# Altium schematic sheet Driver.SchDoc (part 1 of 2)
size 1600 x 1200 mm; SheetNumber: 1; SheetTotal: 1; SPICEModelCacheBTRAQOWF: <root> / <DocumentId>BTRAQOWF</DocumentId> / <CacheFrame Number="0"> / <Model Name="7850_74477530_1m" Kind="CKT"> / <Text>******* / .subckt 7850_74477530_1m 1 2 / Rp 1 2 187304.915771 / Cp 1 2 4.36976277949p / Rs 1 N3 3.3 / L1 N3 2 1000u / .ends 7850_74477530_1m</Text> / </Model> / </CacheFrame> / </root>
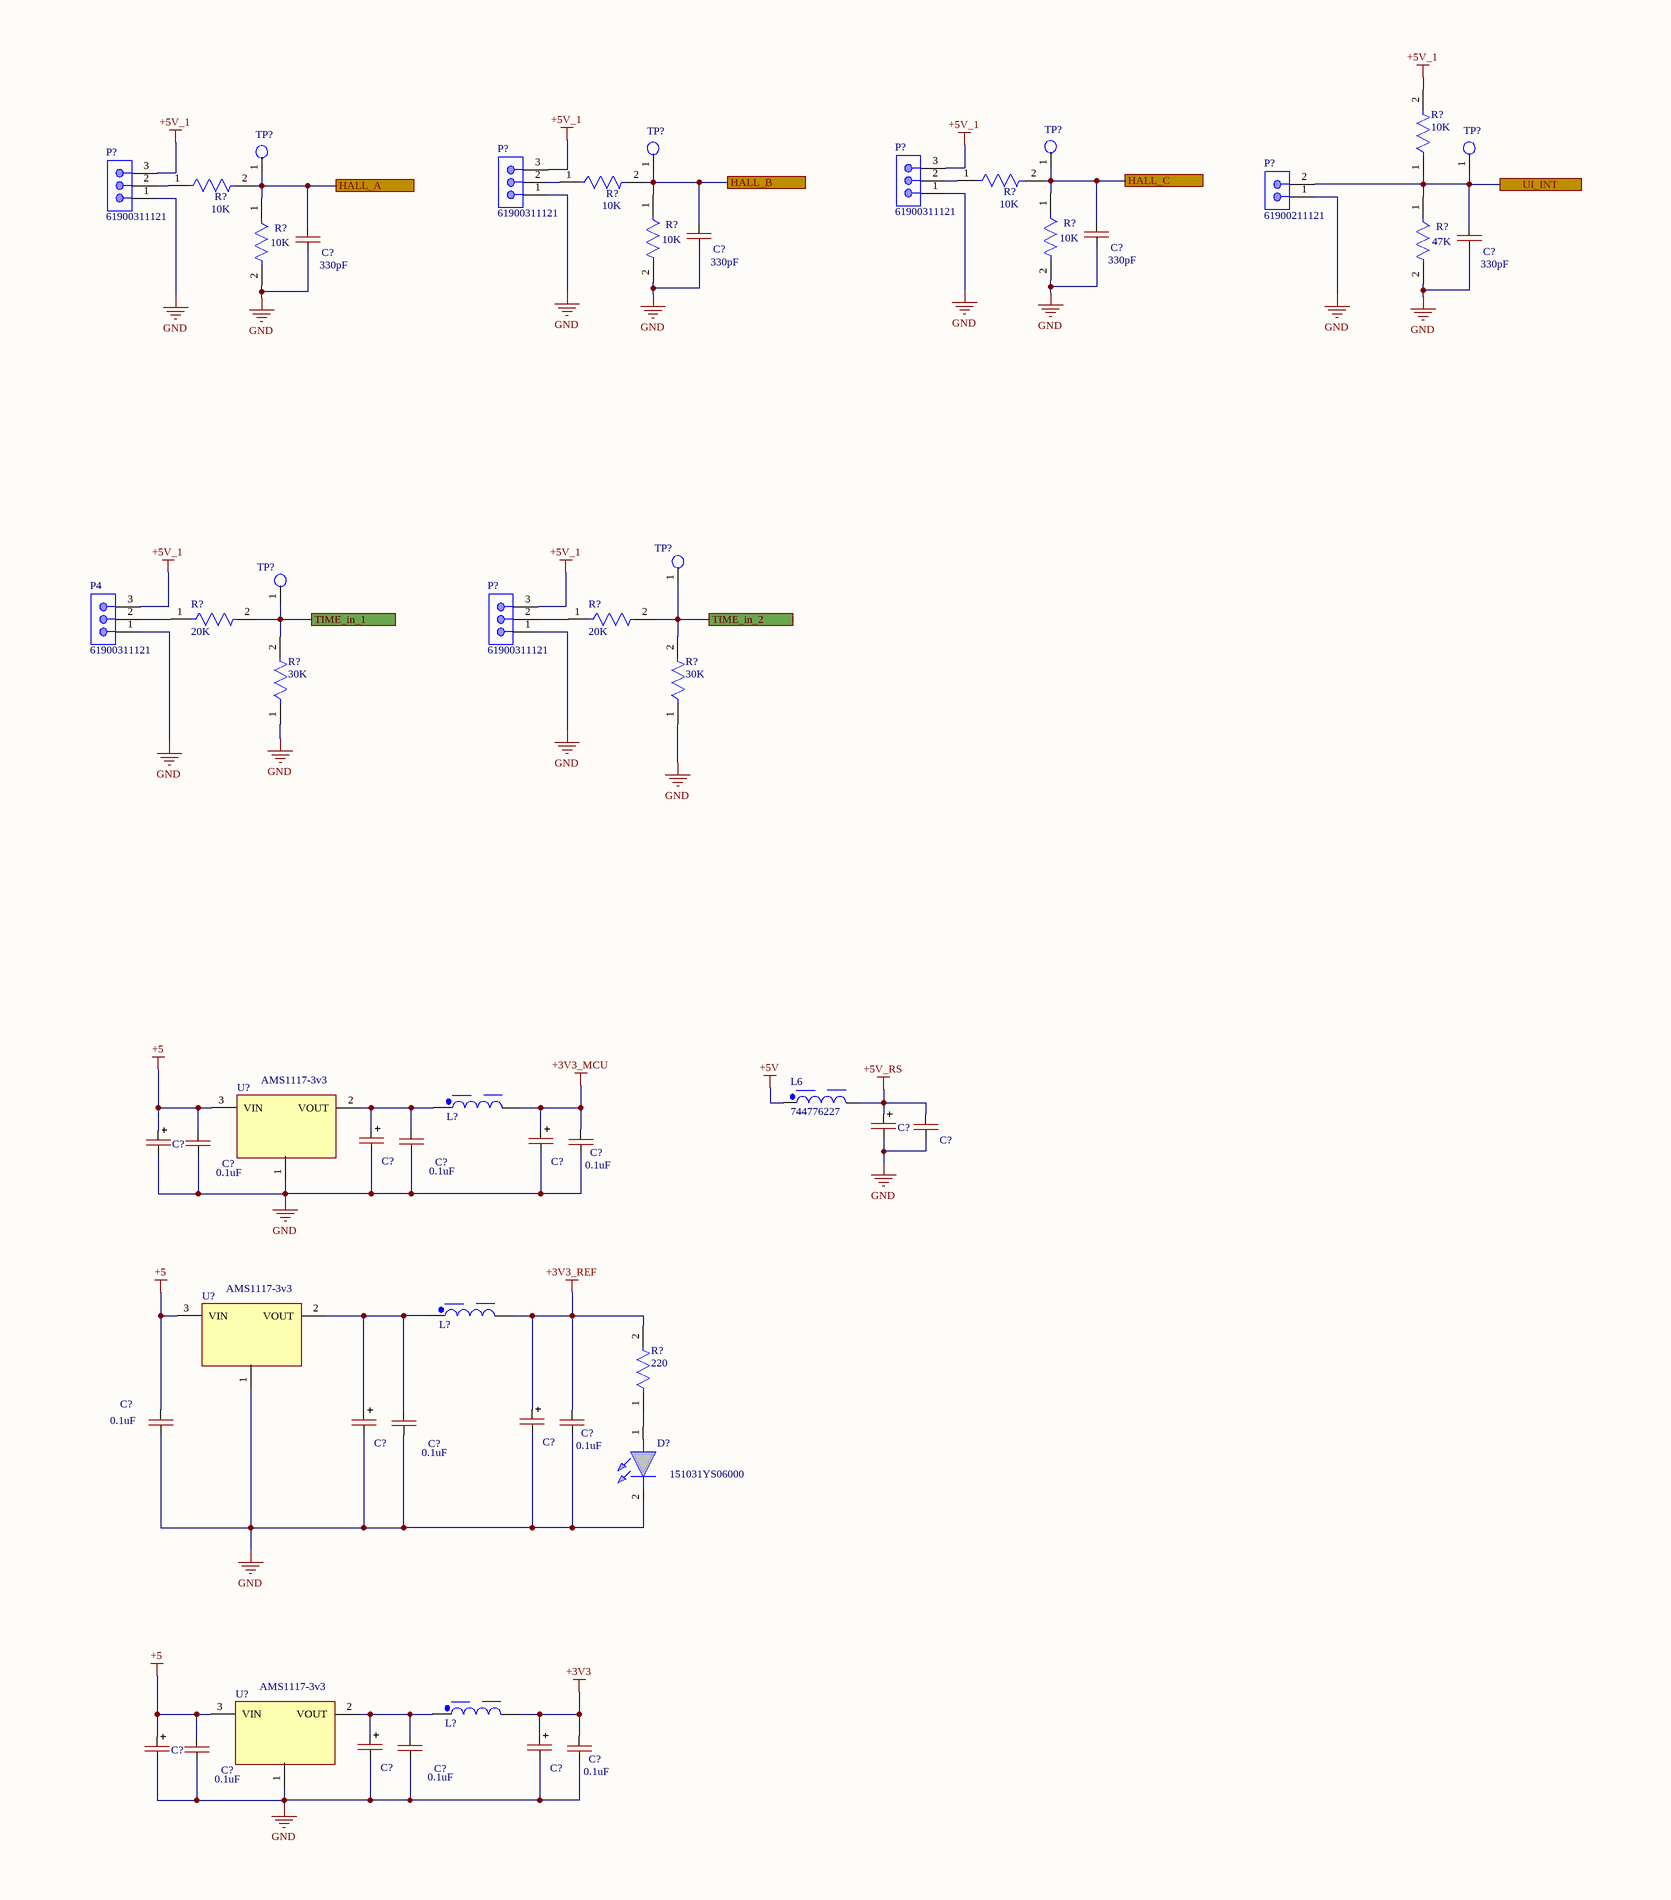
[diagram p0: Driver.SchDoc, top column 1 of 4]
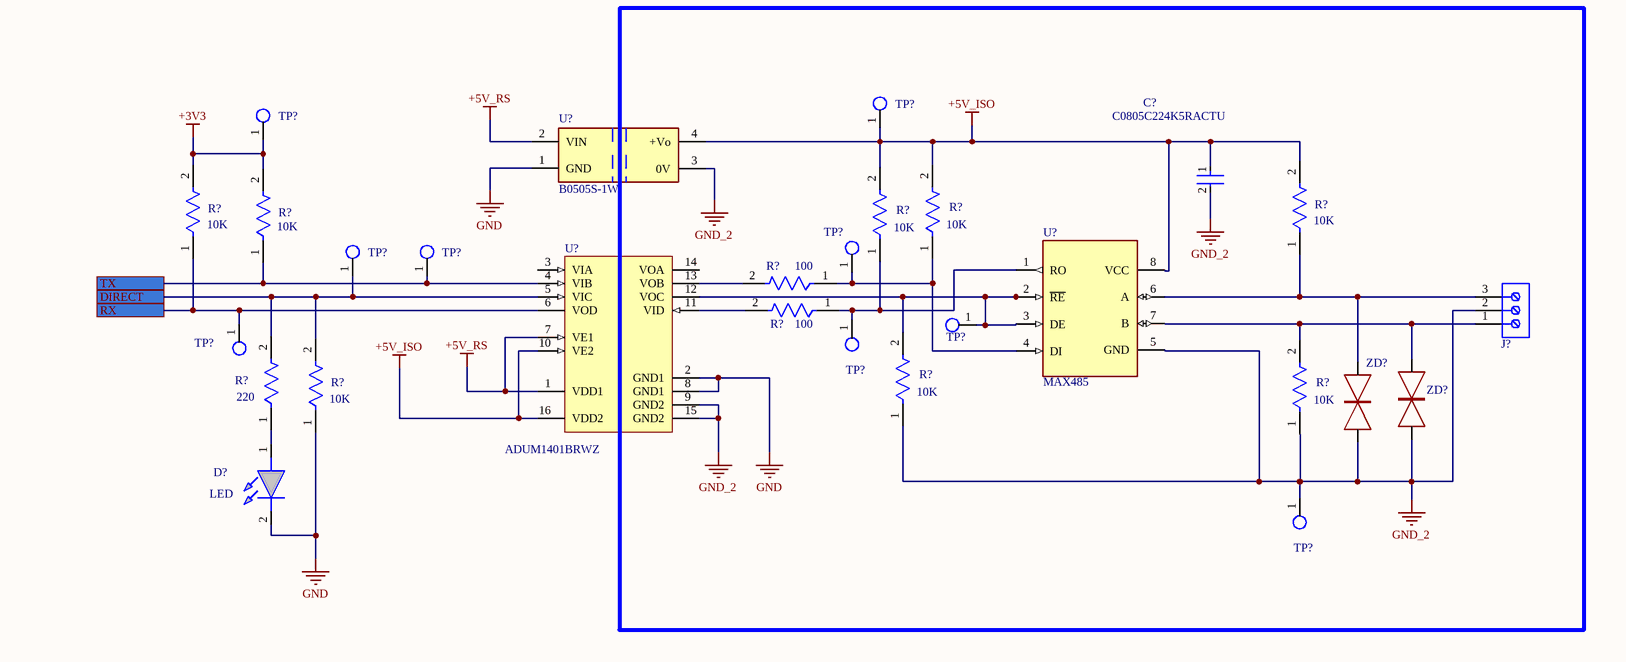
[diagram p1: Driver.SchDoc, top column 2 of 4]
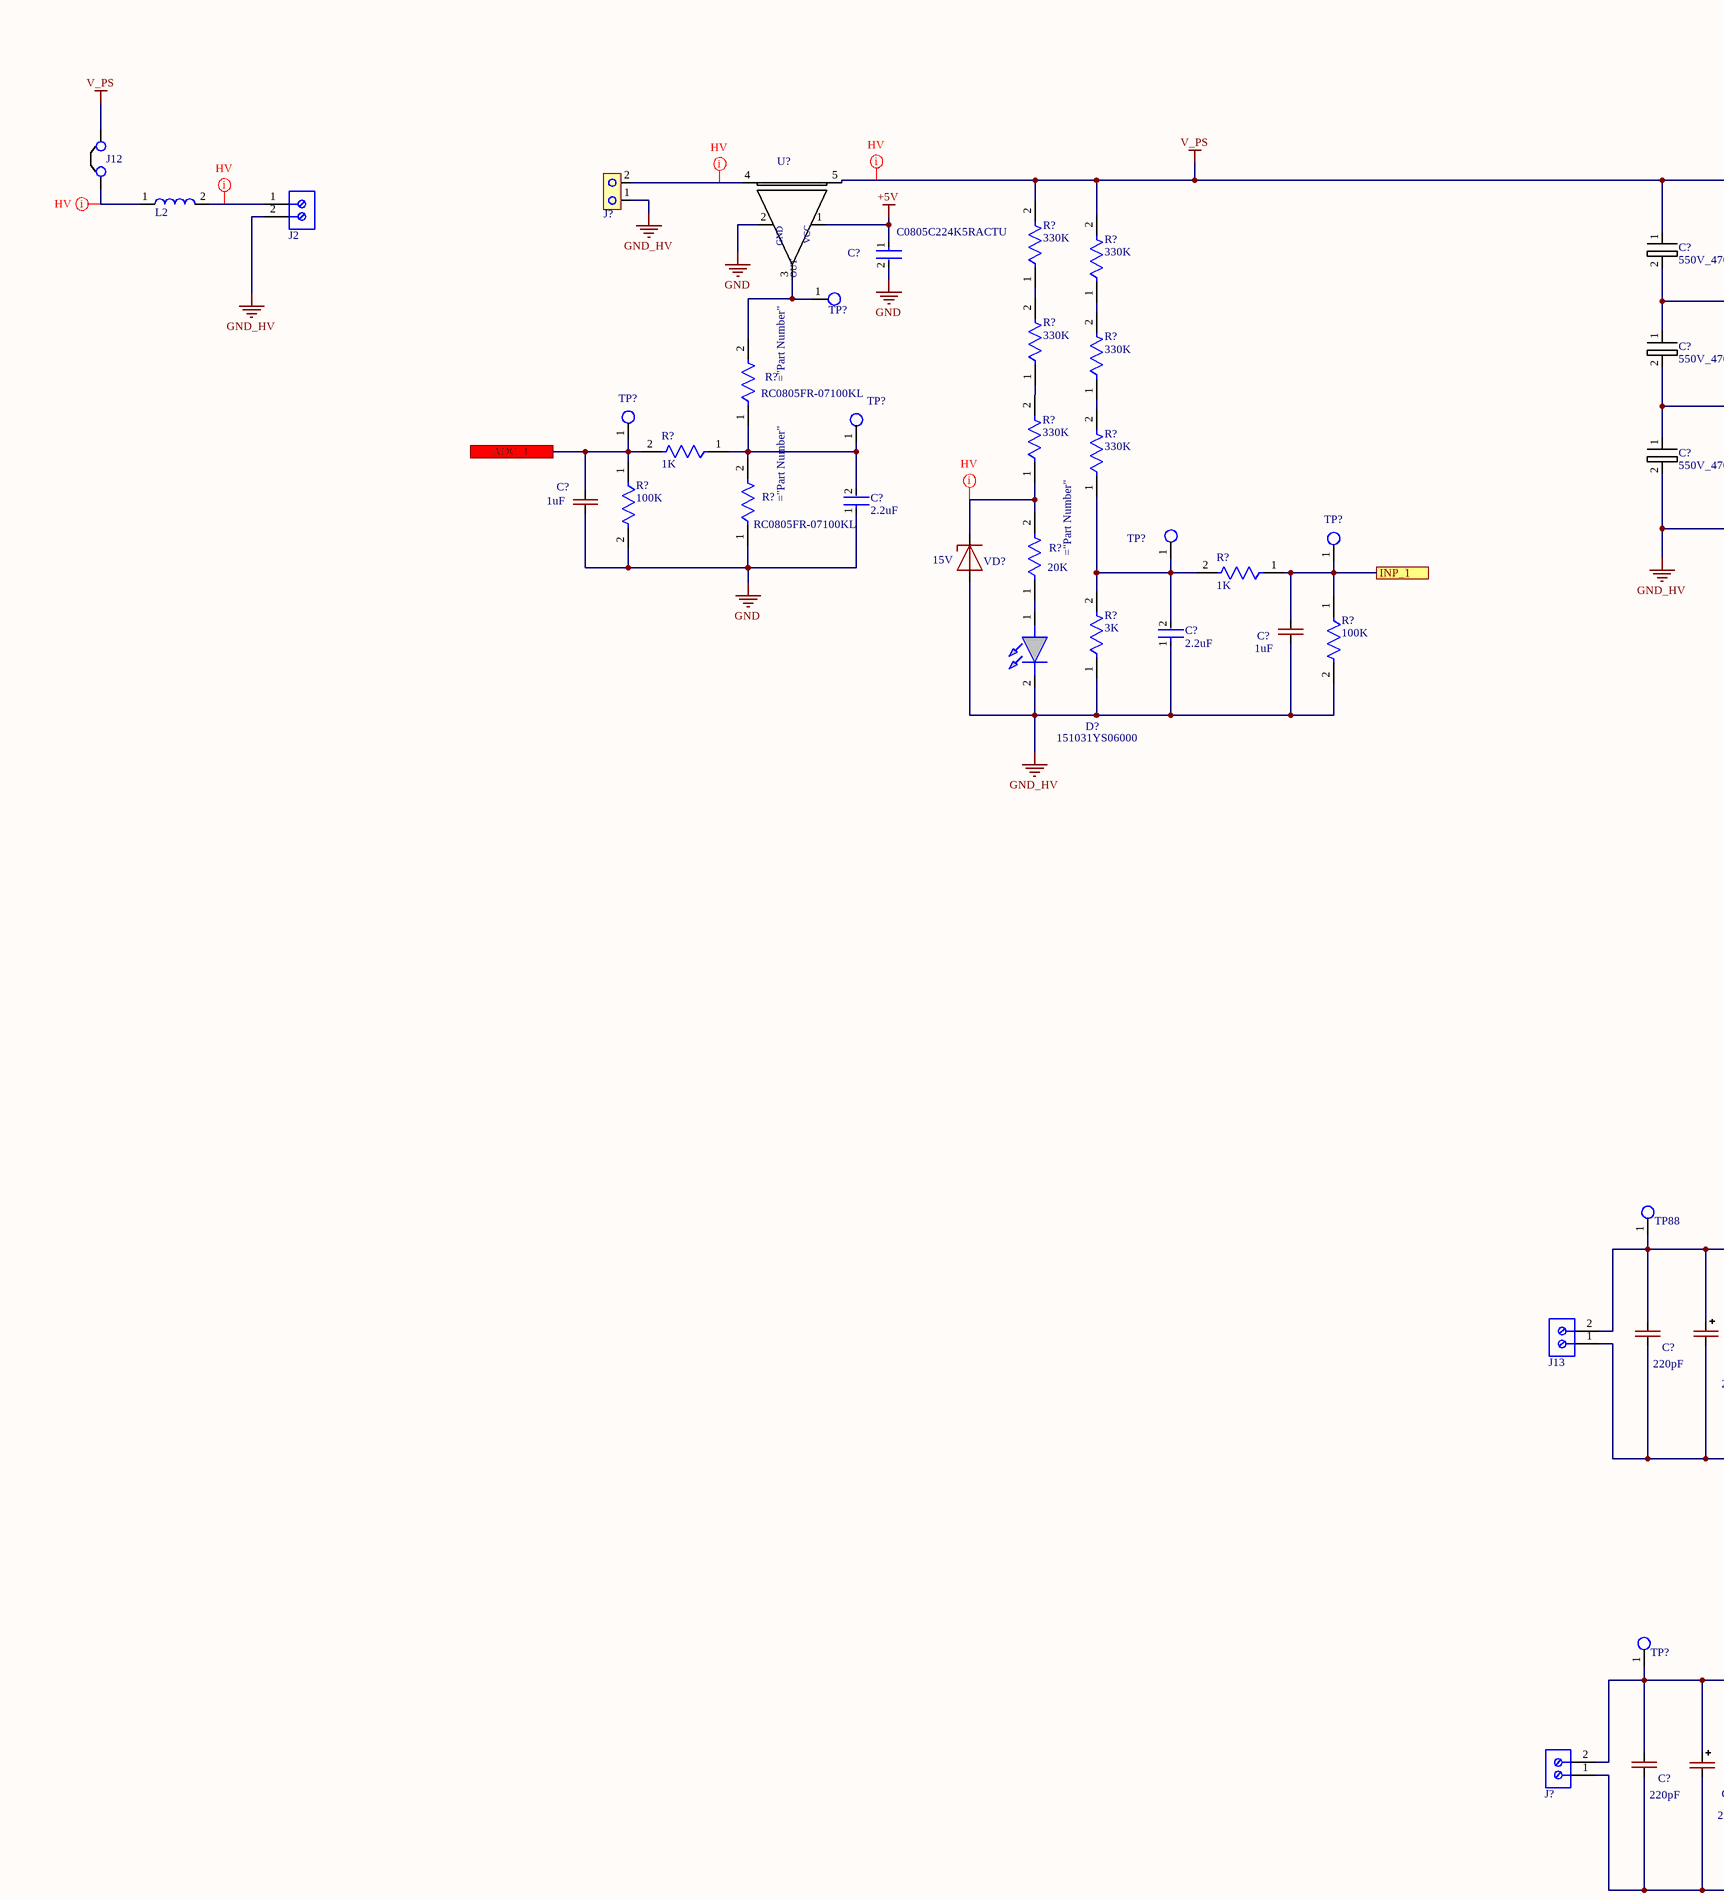
[diagram p2: Driver.SchDoc, top column 3 of 4]
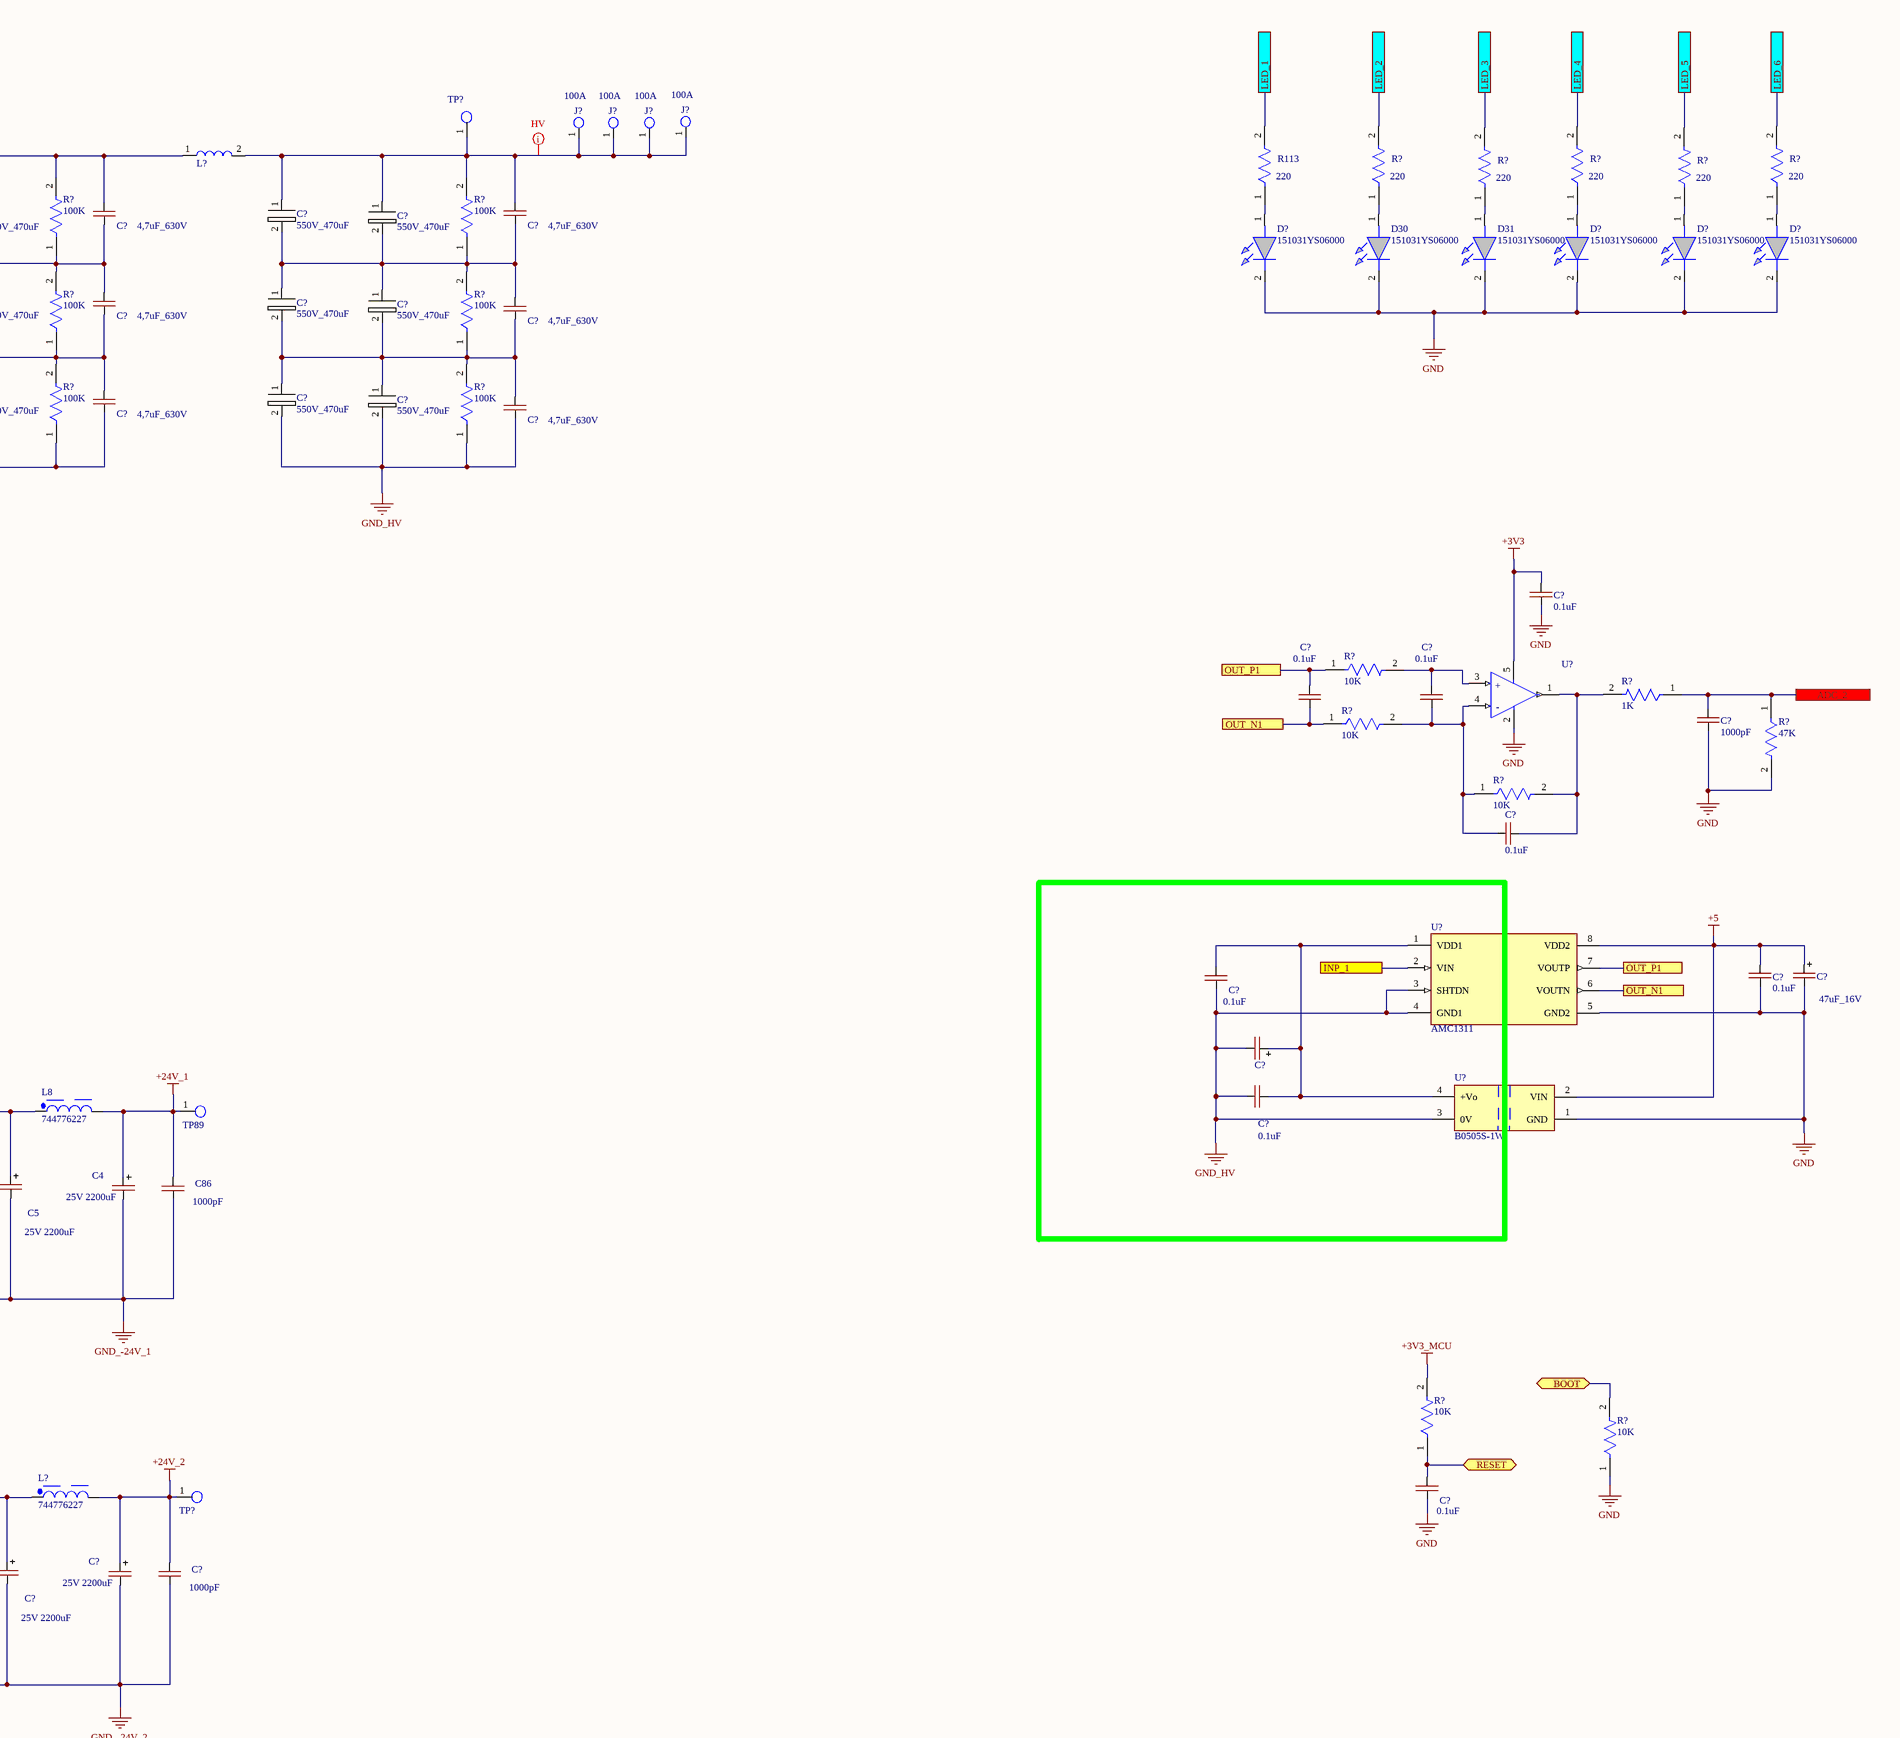
[diagram p3: Driver.SchDoc, top column 4 of 4]
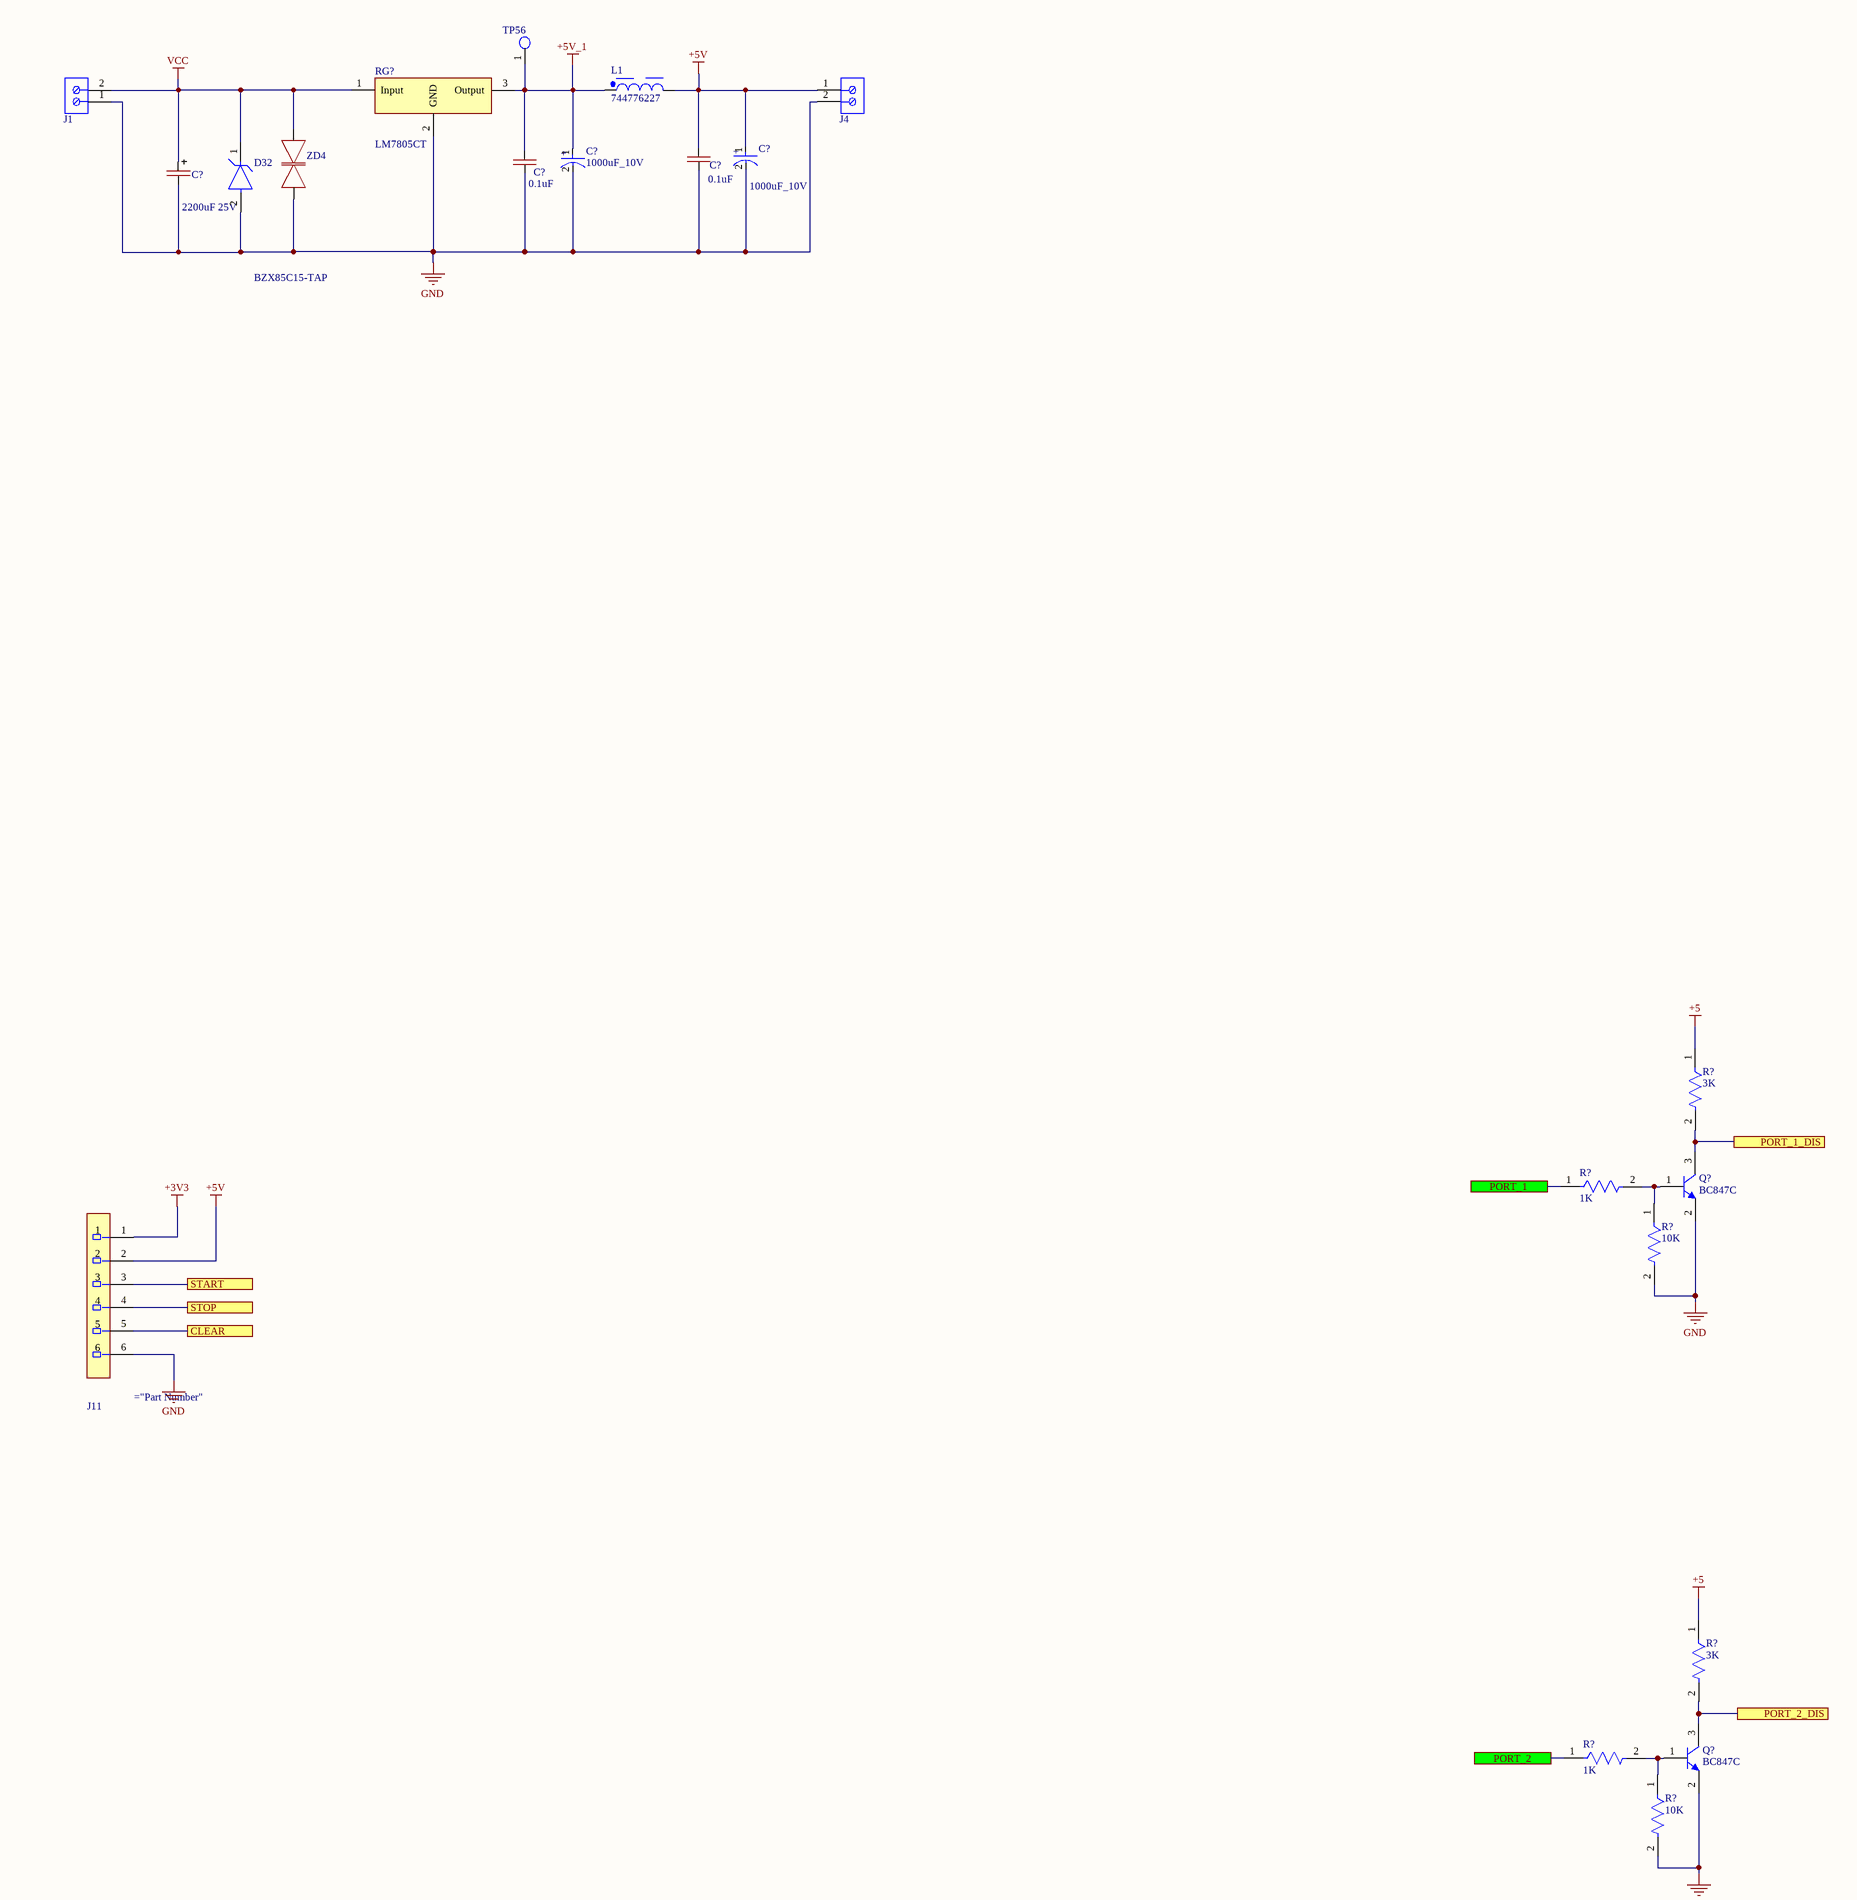
[diagram p4: Driver.SchDoc, centre column 1 of 4]
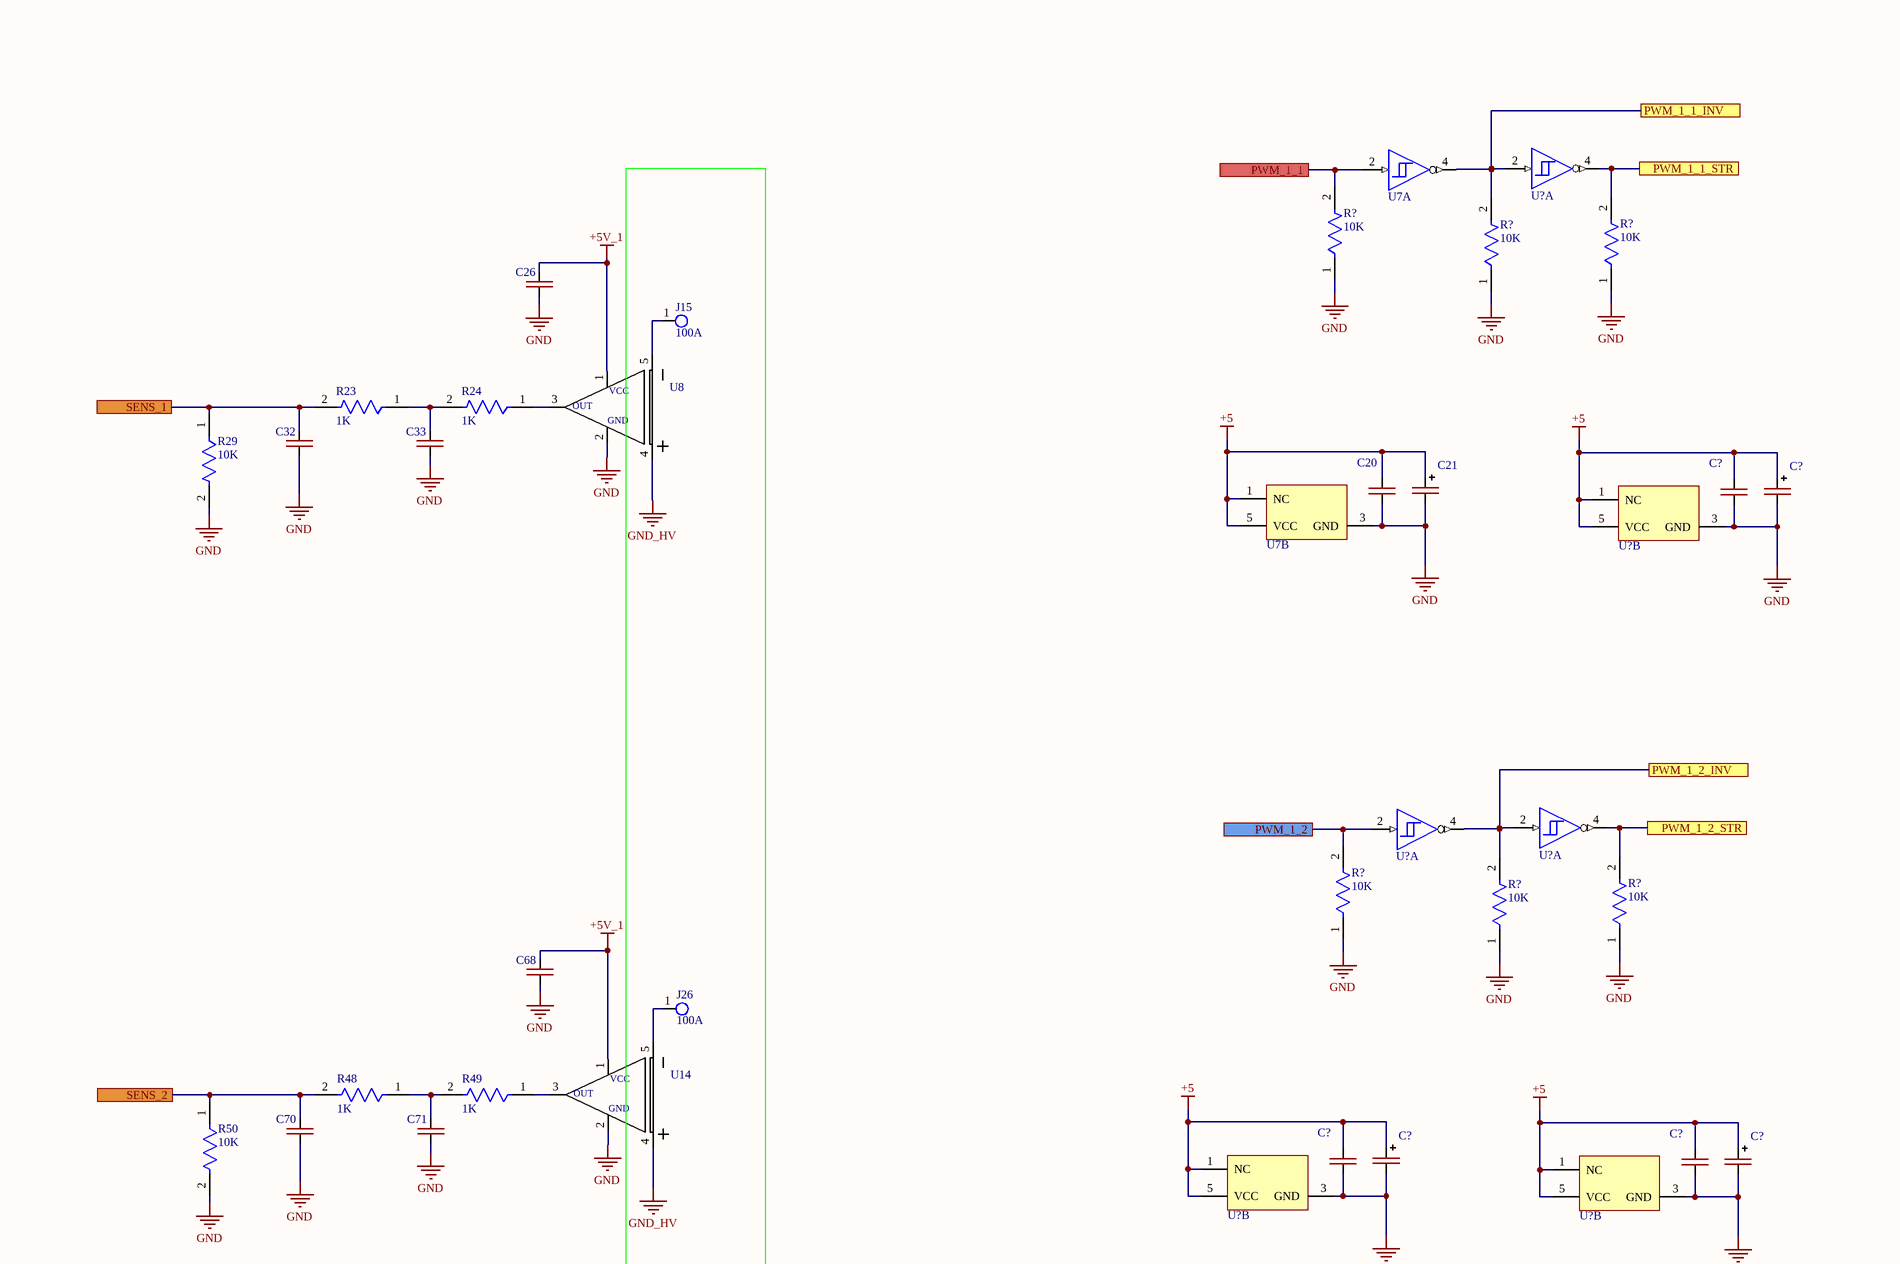
[diagram p5: Driver.SchDoc, centre column 2 of 4]
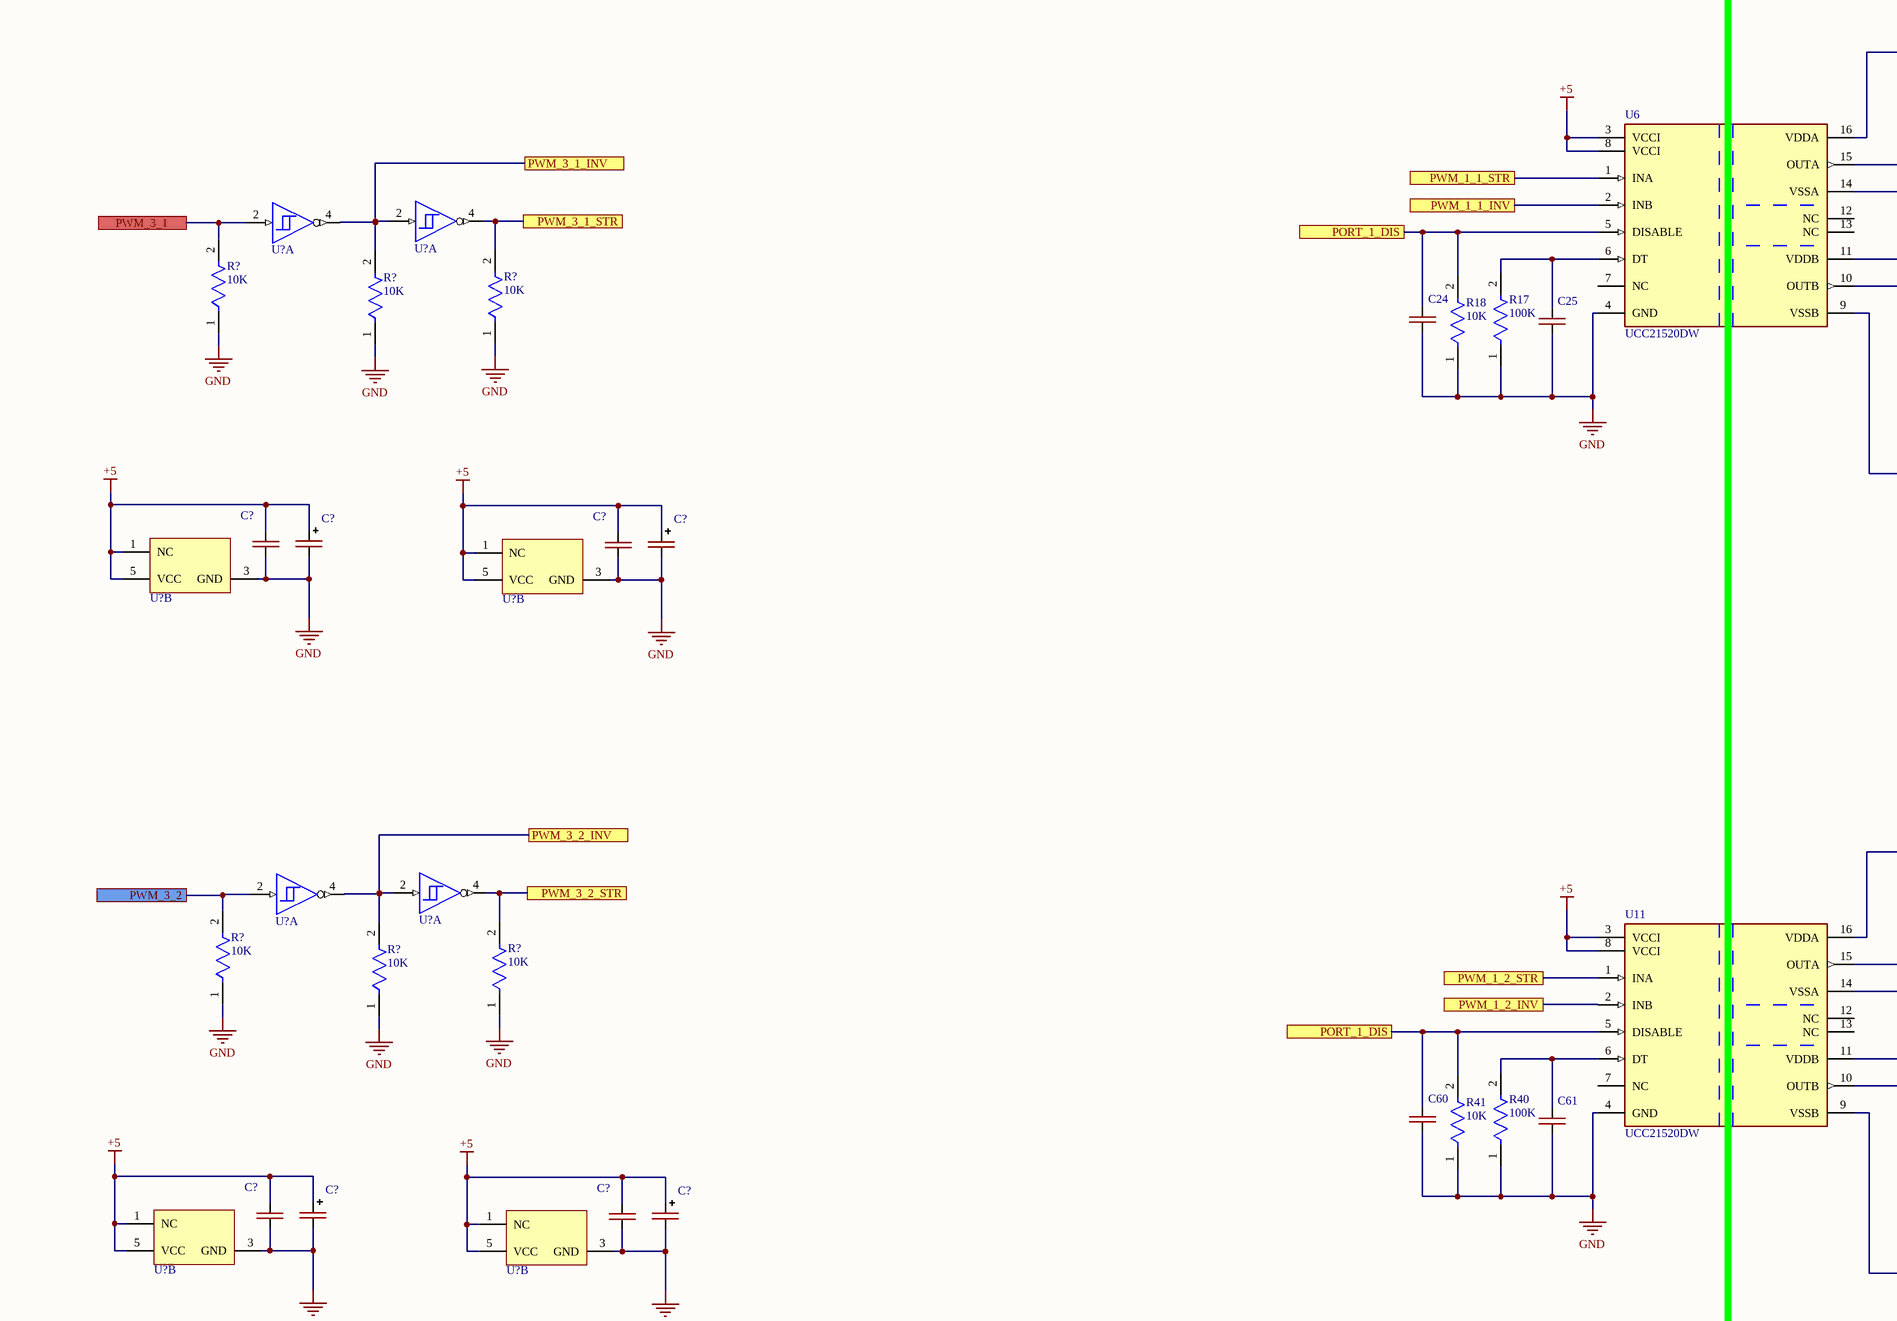
[diagram p6: Driver.SchDoc, centre column 3 of 4]
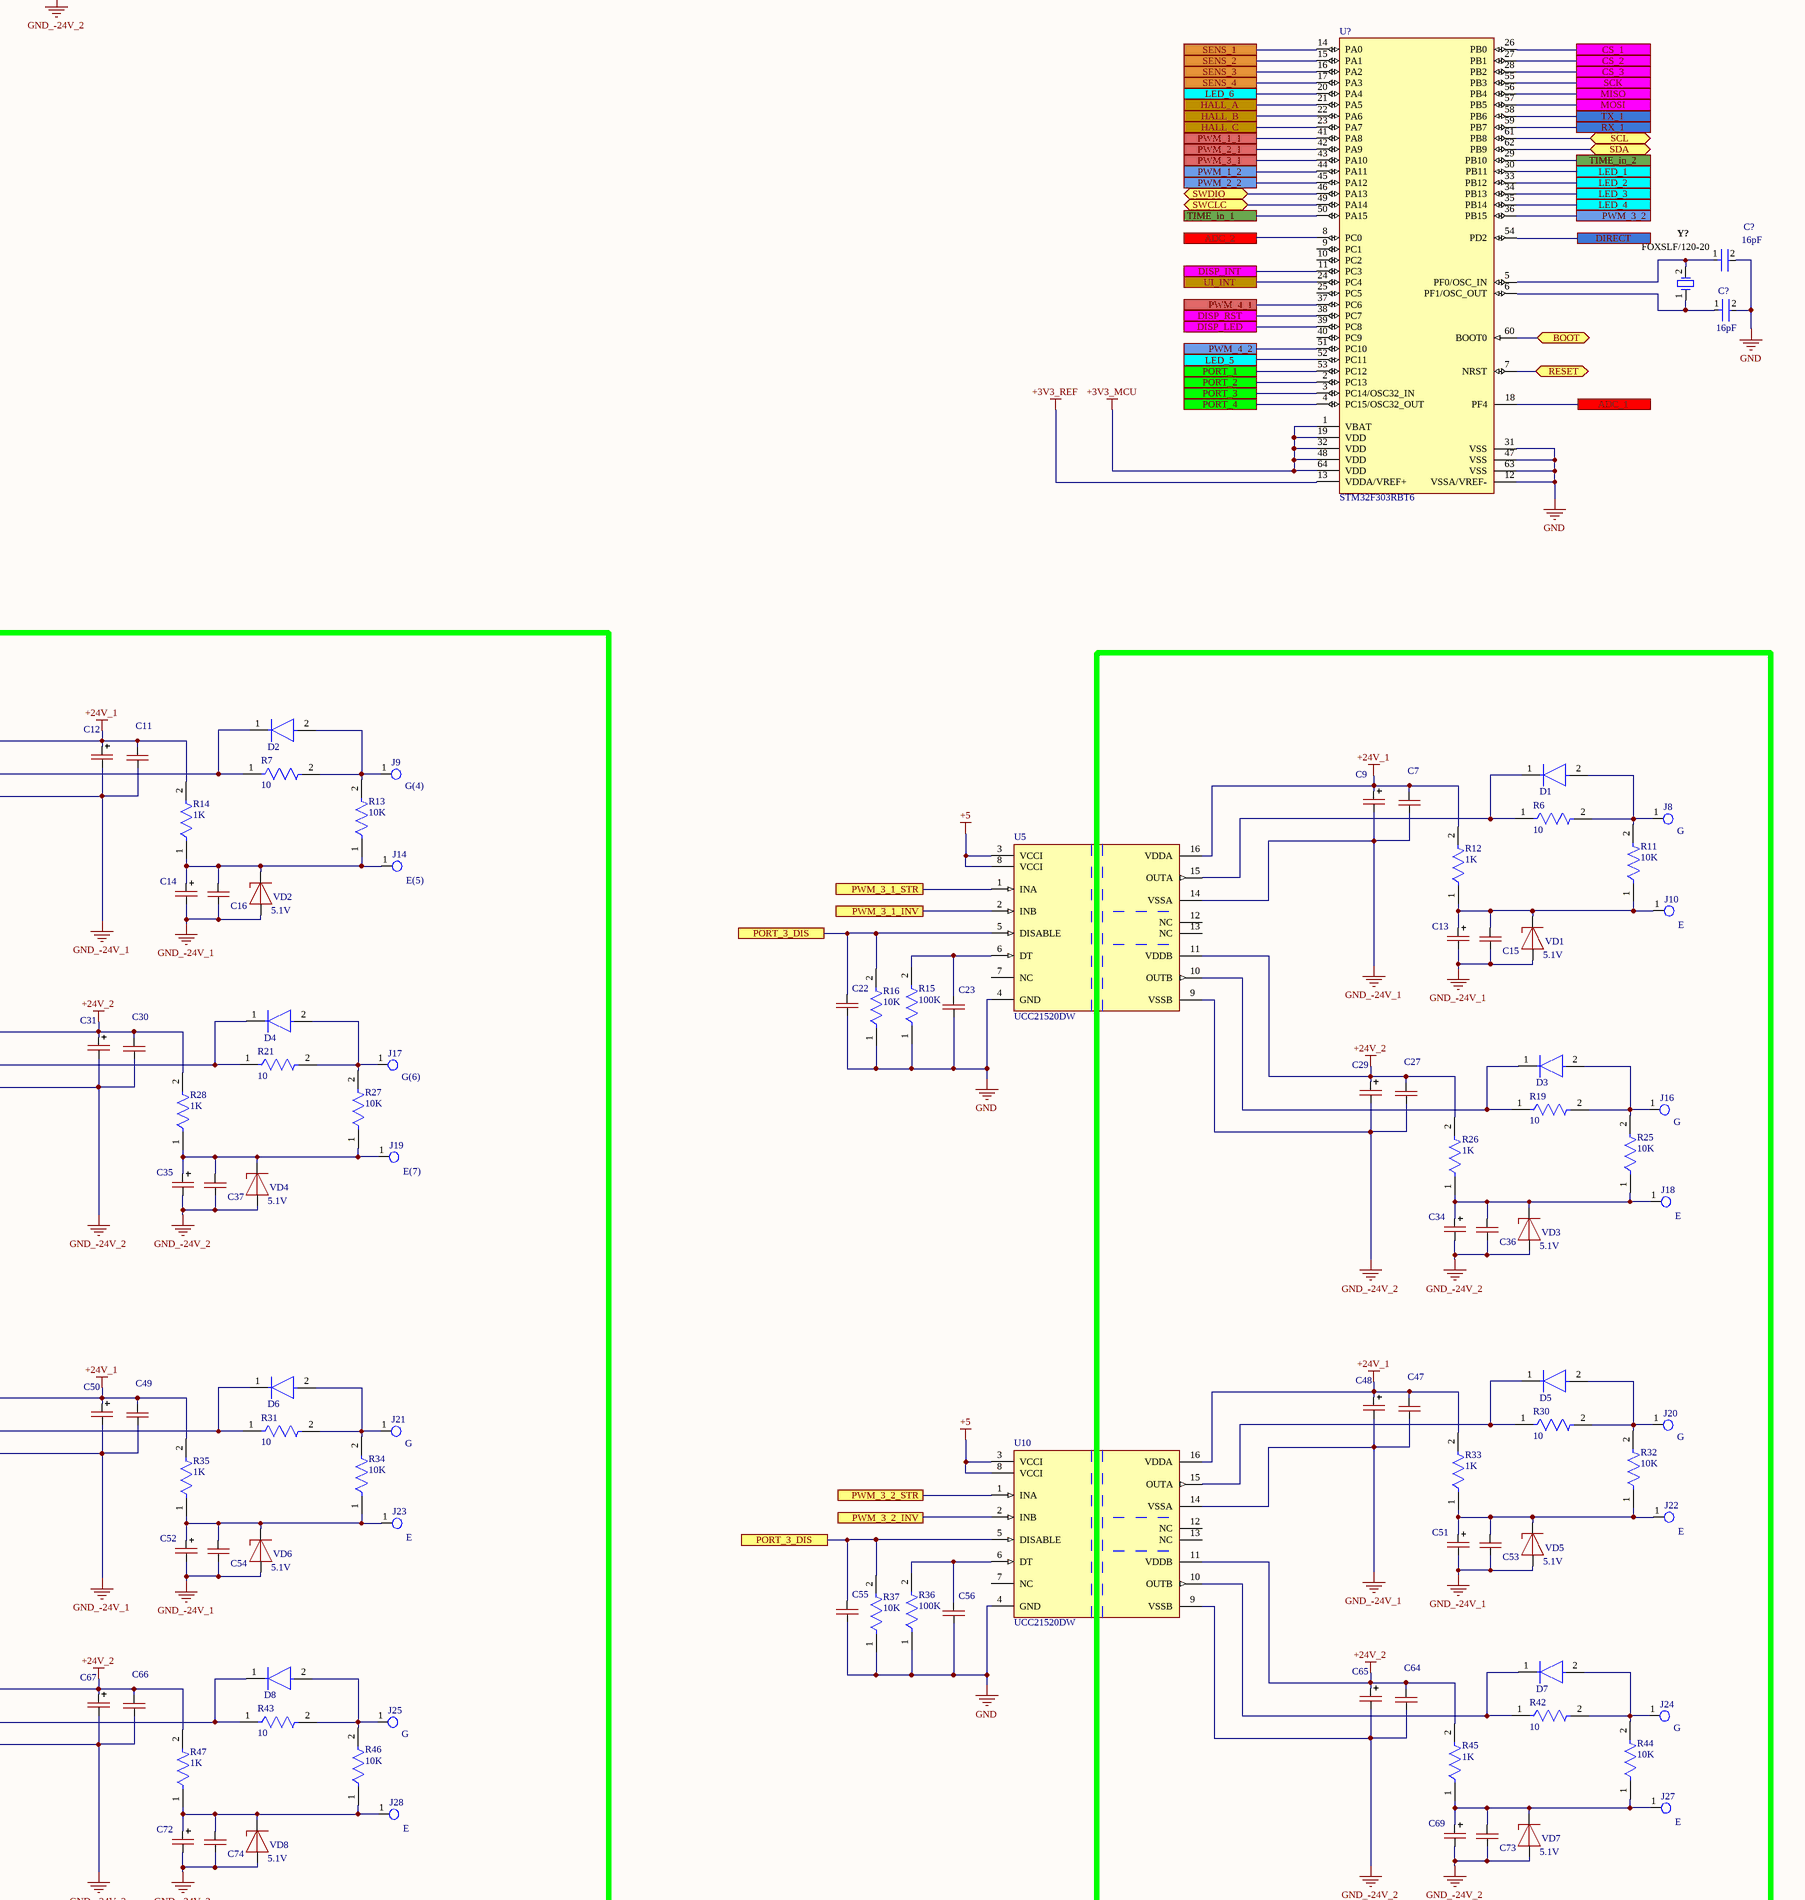
[diagram p7: Driver.SchDoc, centre column 4 of 4]
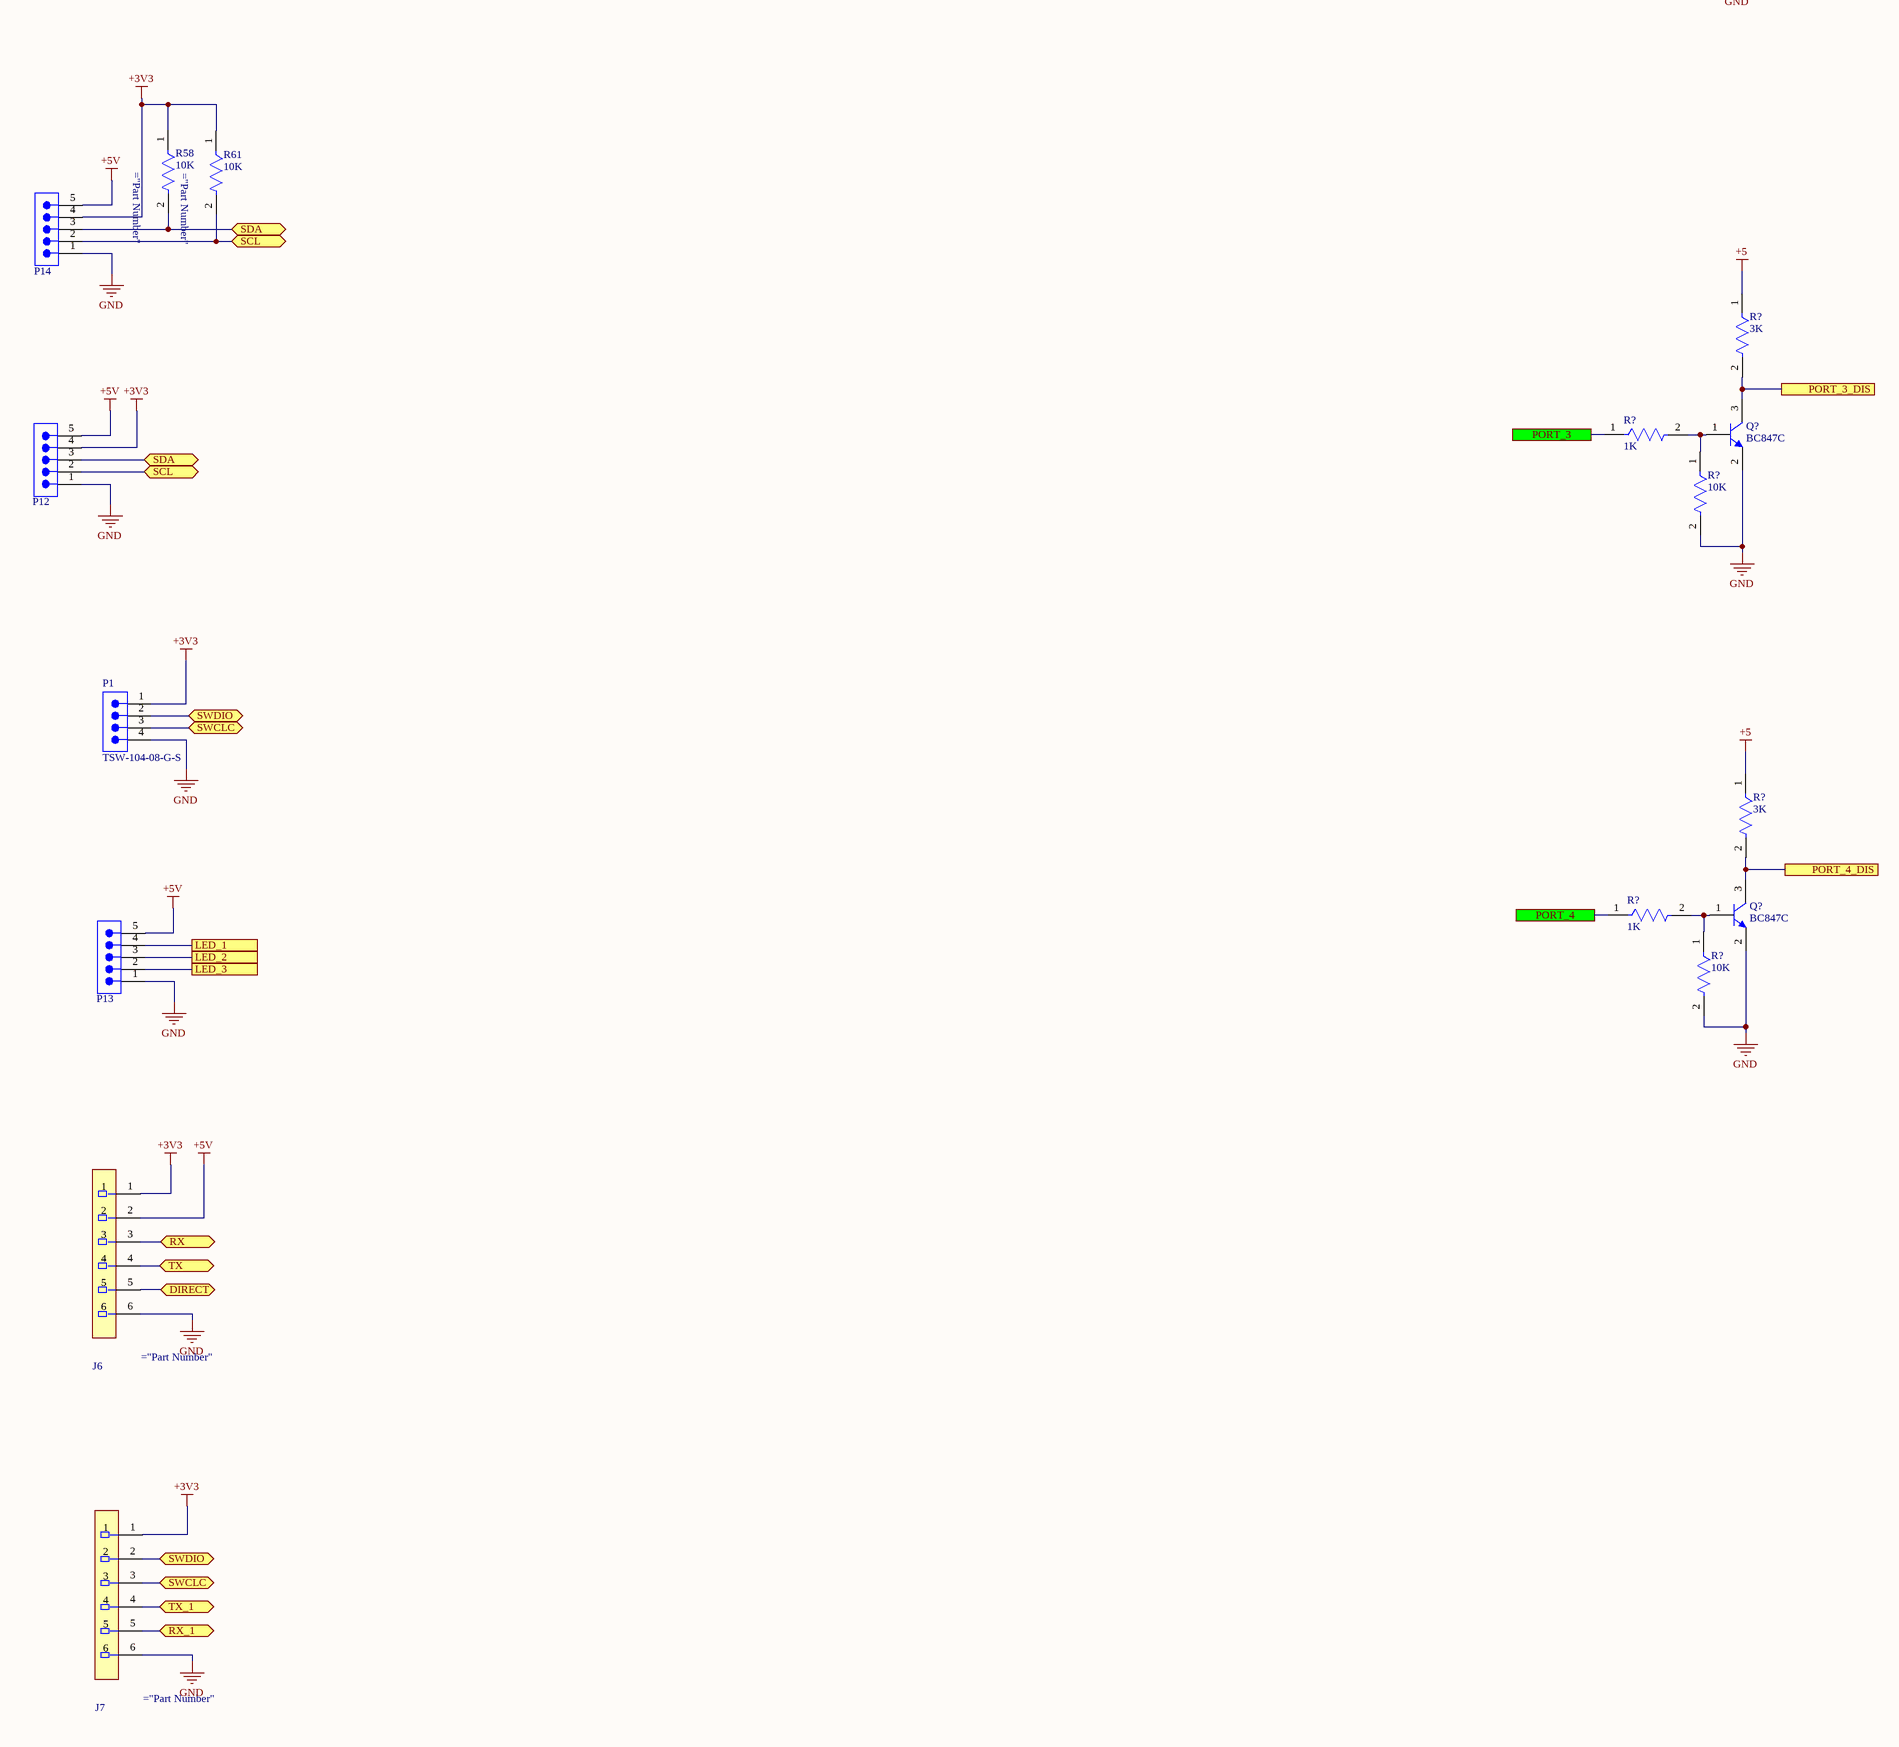
[diagram p8: Driver.SchDoc, bottom column 1 of 4]
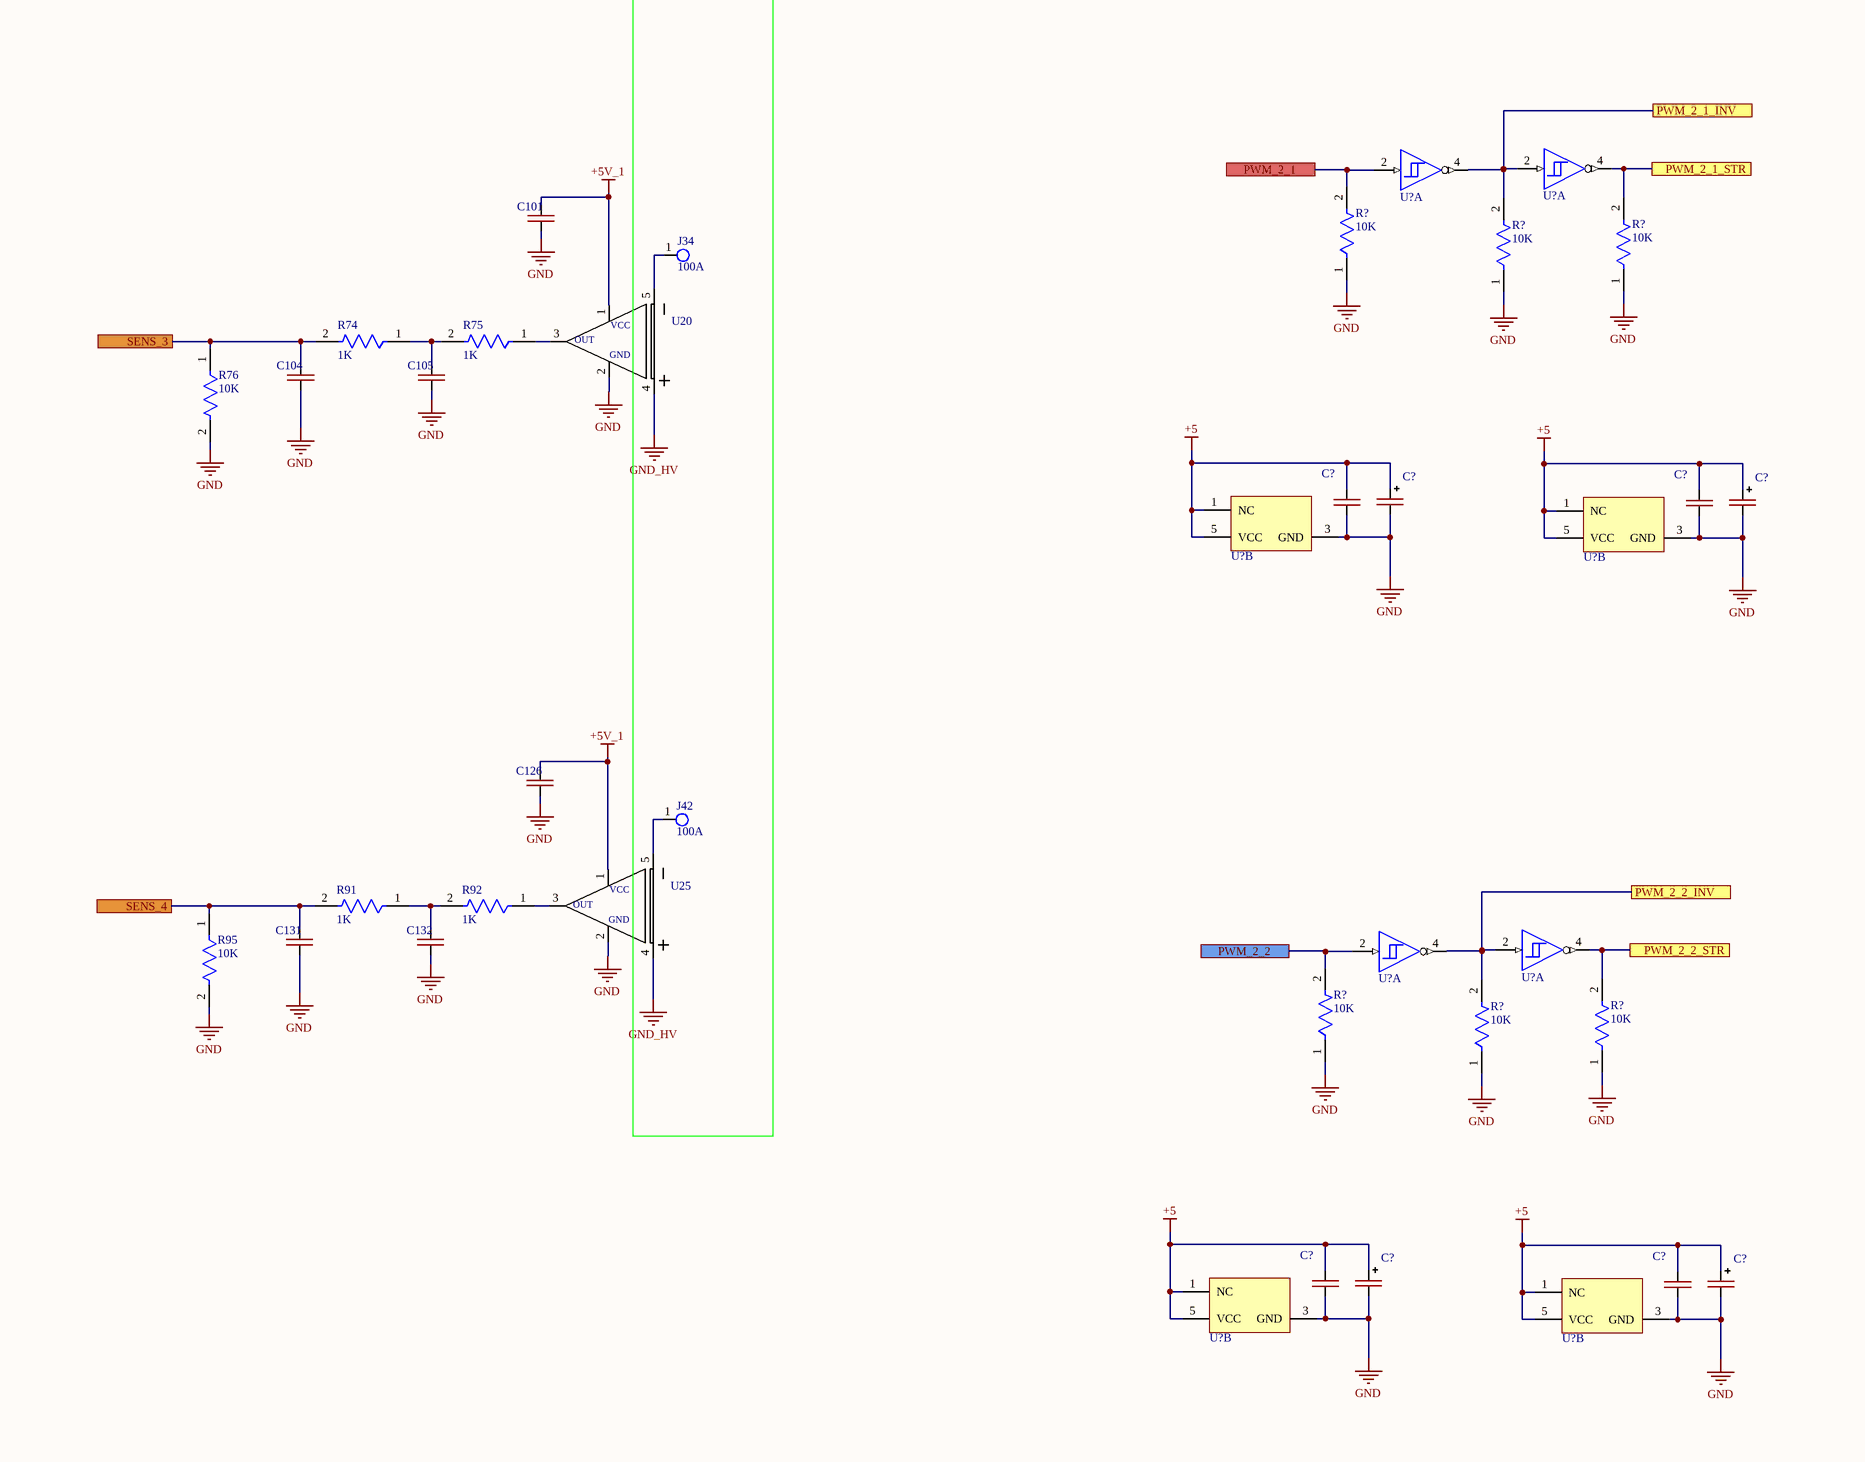
[diagram p9: Driver.SchDoc, bottom column 2 of 4]
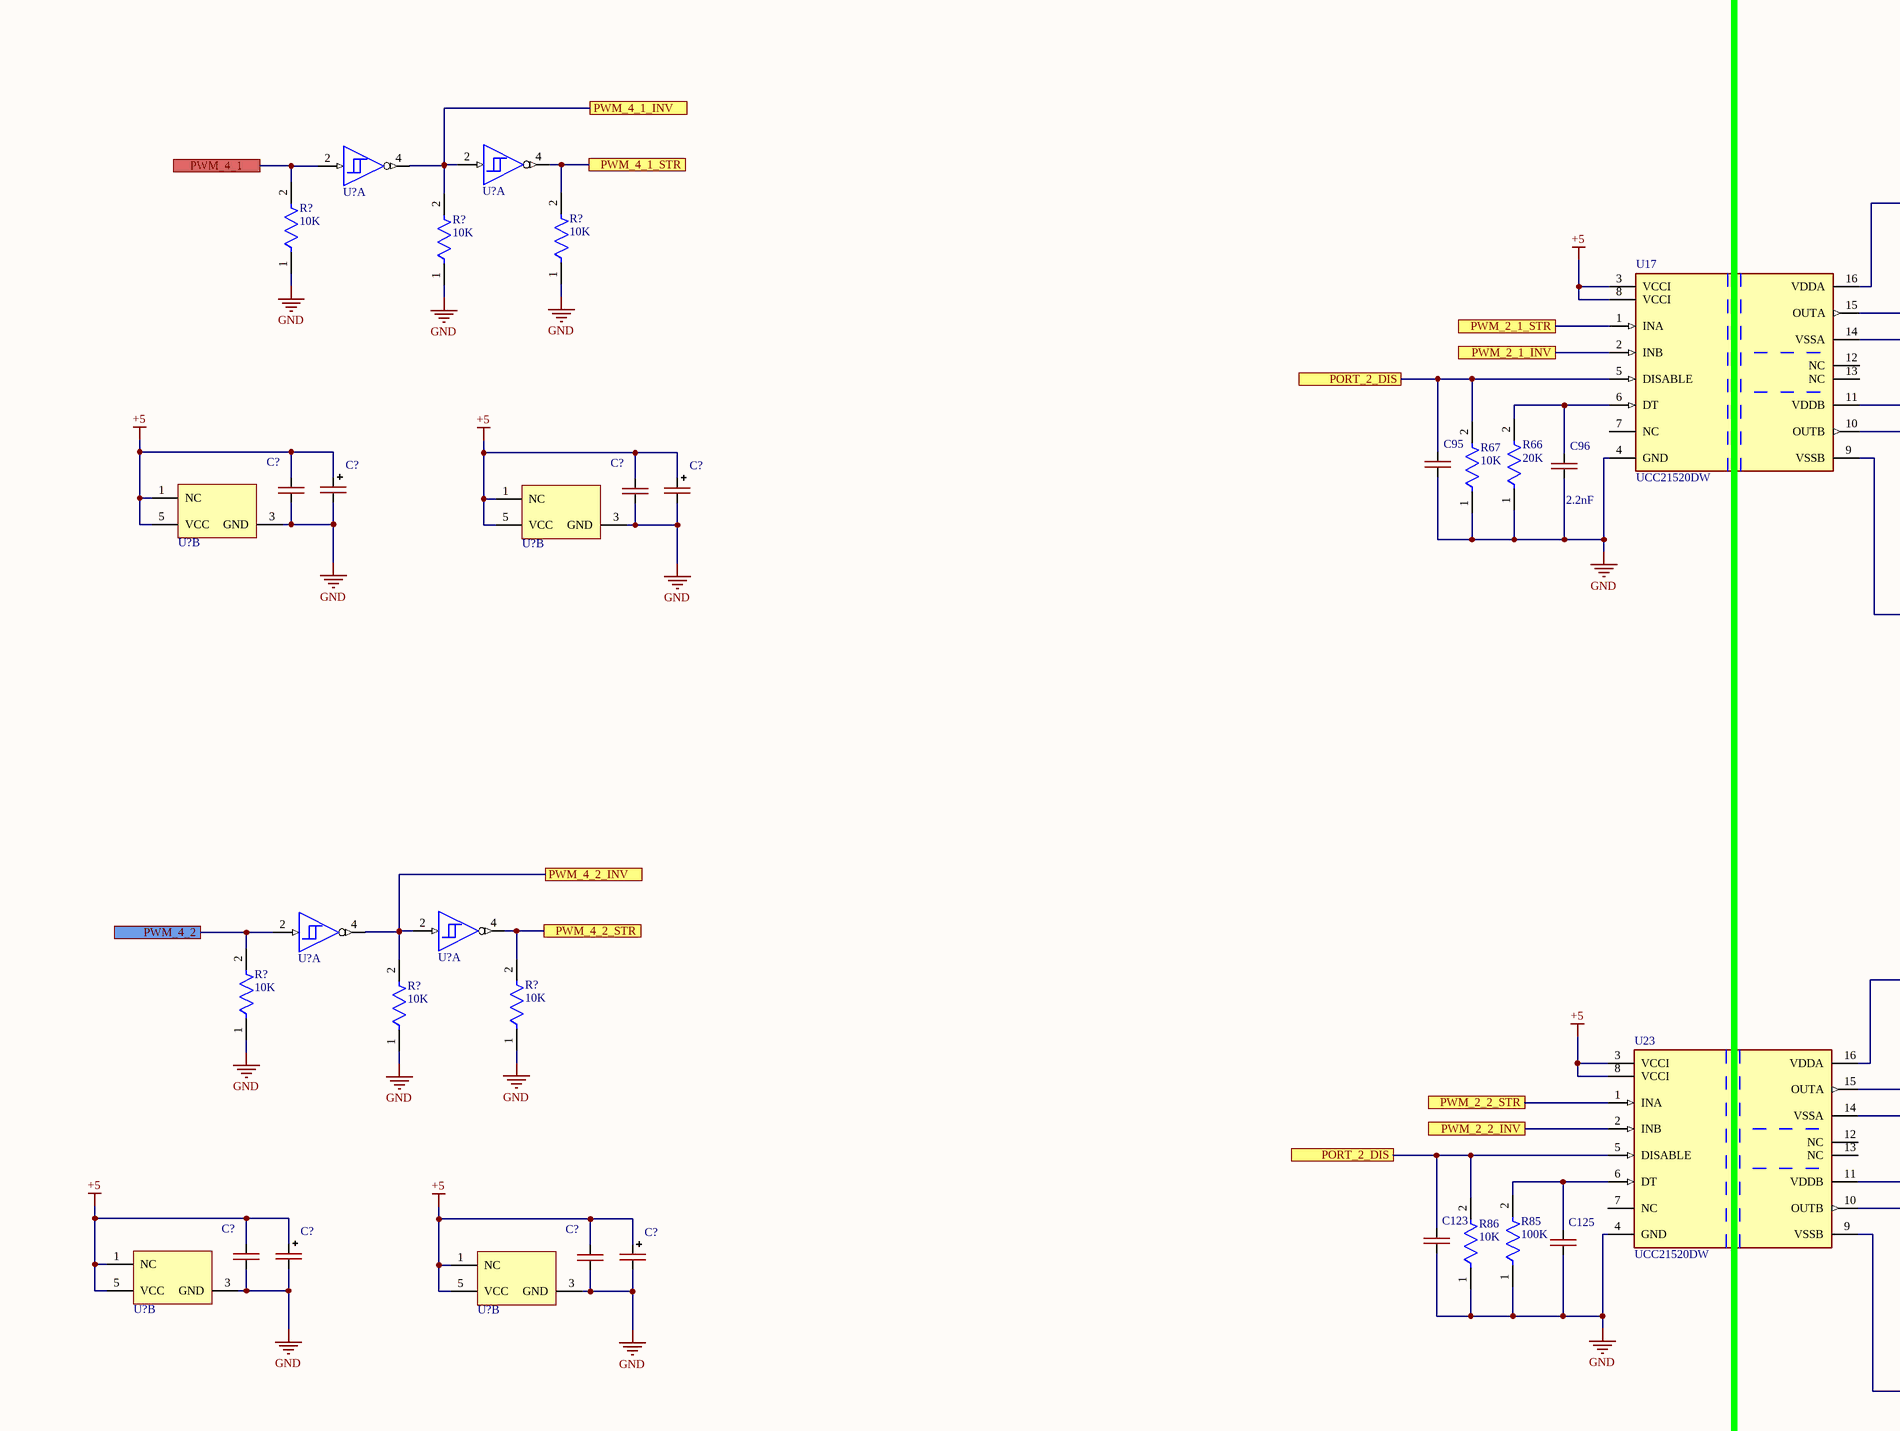
[diagram p10: Driver.SchDoc, bottom column 3 of 4]
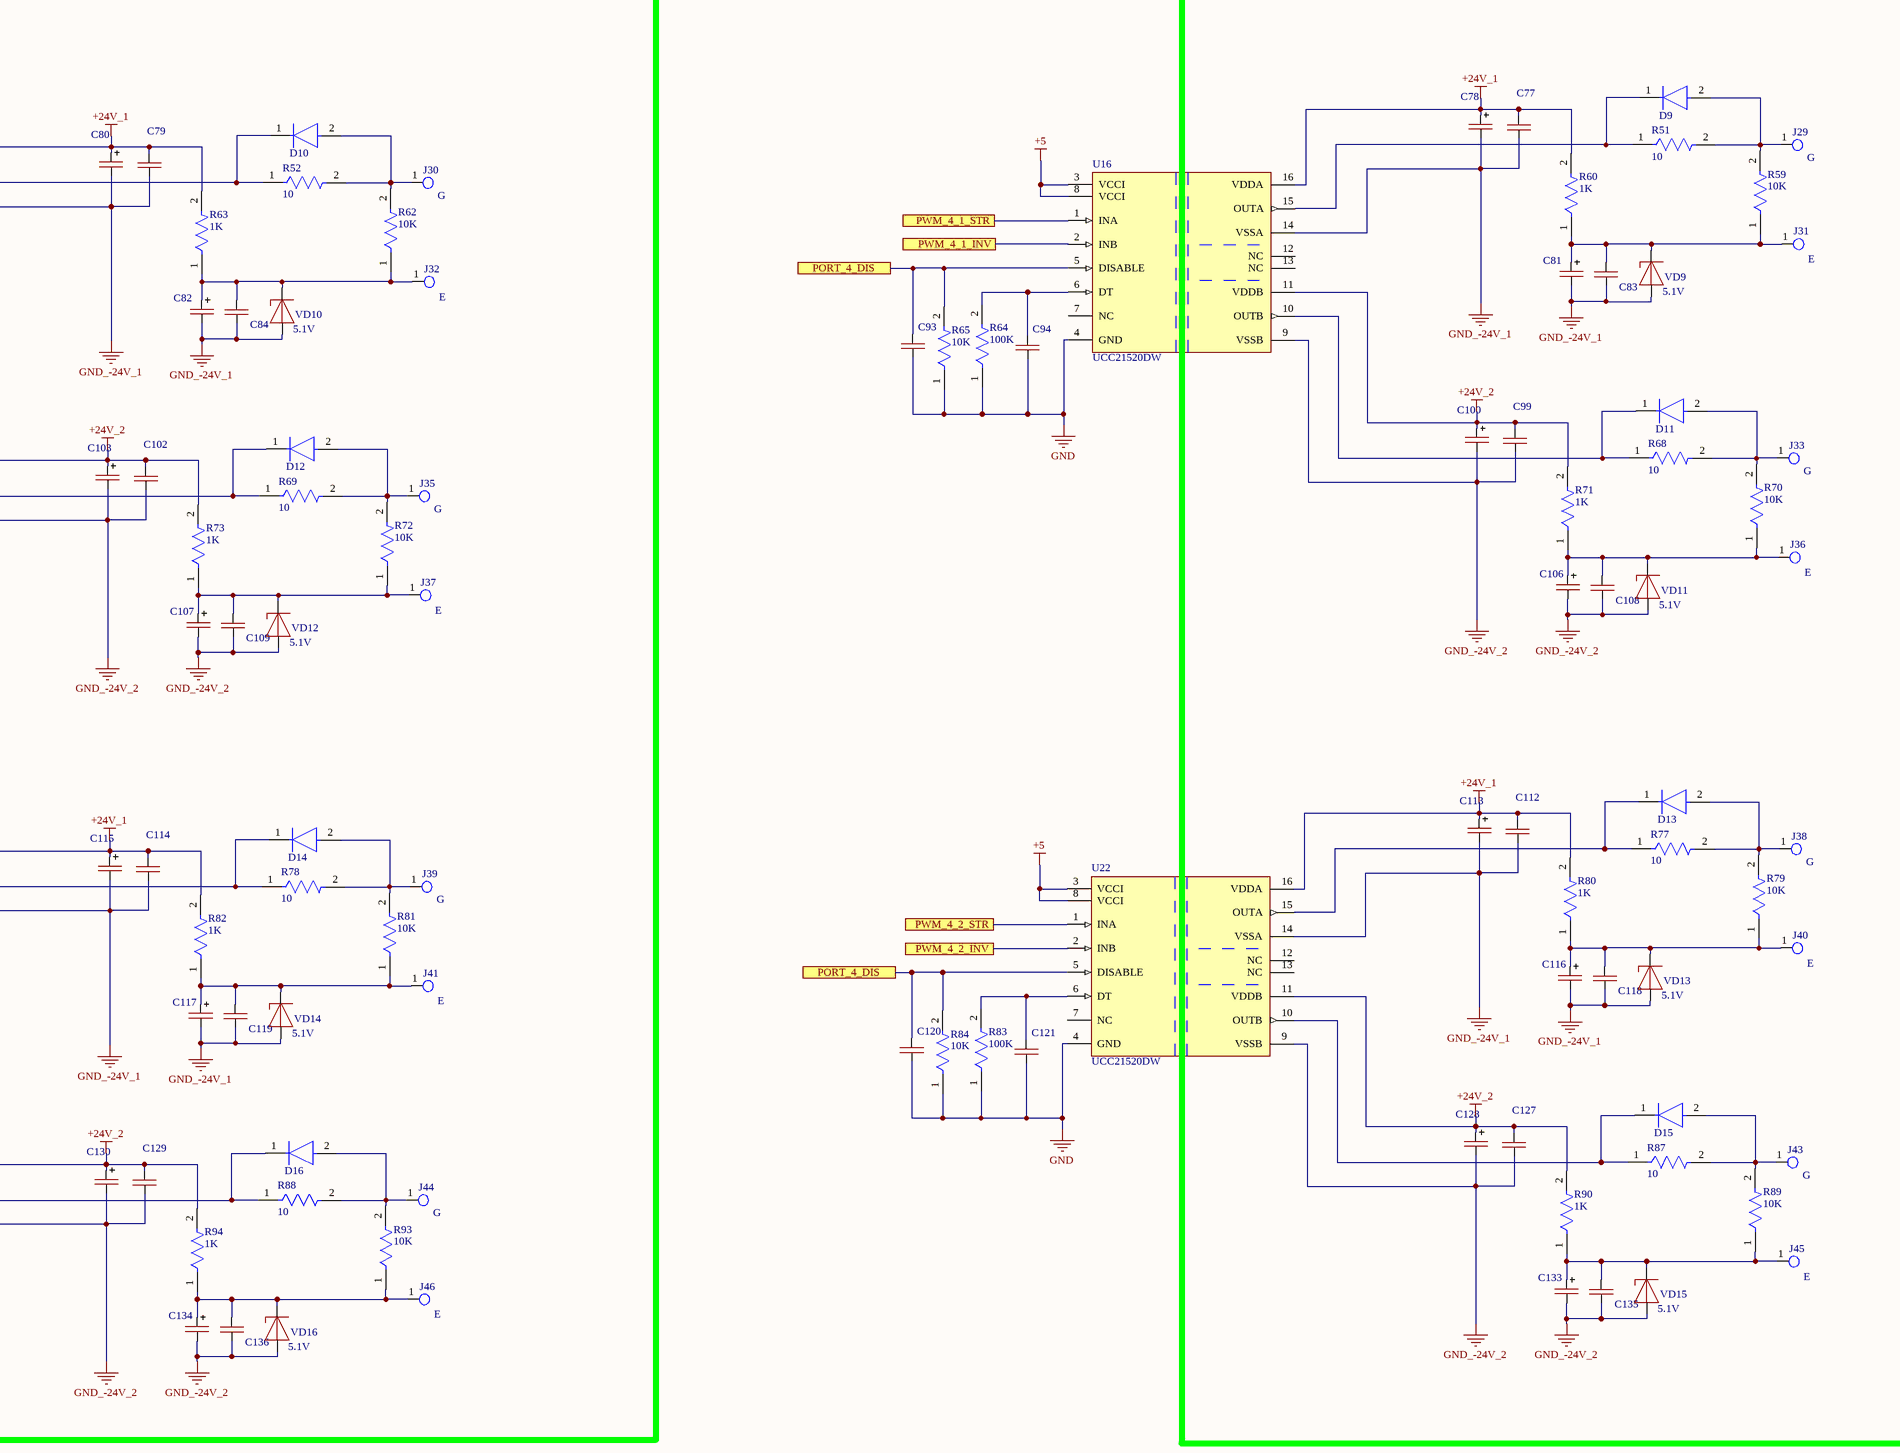
[diagram p11: Driver.SchDoc, bottom column 4 of 4]

## Parts
(Parts that share a designator on the sheet are numbered #1, #2 ... from top to bottom, then left to right.)
C4  25V 2200uF  [CAPPOL-12x25]
C5  25V 2200uF  [CAPPOL-12x25]
C7  CAP-NON-POLAR  [CAP-0805]  (value not drawn)
C9  CAP-POLAR  [CAPPOL-16x25]  (value not drawn)
C11  CAP-NON-POLAR  [CAP-0805]  (value not drawn)
C12  CAP-POLAR  [CAPPOL-16x25]  (value not drawn)
C13  CAP-POLAR  [CAP-TAN-D]  (value not drawn)
C14  CAP-POLAR  [CAP-TAN-D]  (value not drawn)
C15  CAP-NON-POLAR  [CAP-0805]  (value not drawn)
C16  CAP-NON-POLAR  [CAP-0805]  (value not drawn)
C20  CAP-NON-POLAR  [CAP-0805]  (value not drawn)
C21  CAP-POLAR  [CAP-TAN-D]  (value not drawn)
C22  CAP-NON-POLAR  [CAP-0805]  (value not drawn)
C23  CAP-NON-POLAR  [CAP-0805]  (value not drawn)
C24  CAP-NON-POLAR  [CAP-0805]  (value not drawn)
C25  CAP-NON-POLAR  [CAP-0805]  (value not drawn)
C26  CAP-NON-POLAR  [CAP-0805]  (value not drawn)
C27  CAP-NON-POLAR  [CAP-0805]  (value not drawn)
C29  CAP-POLAR  [CAPPOL-16x25]  (value not drawn)
C30  CAP-NON-POLAR  [CAP-0805]  (value not drawn)
C31  CAP-POLAR  [CAPPOL-16x25]  (value not drawn)
C32  CAP-NON-POLAR  [CAP-0805]  (value not drawn)
C33  CAP-NON-POLAR  [CAP-0805]  (value not drawn)
C34  CAP-POLAR  [CAP-TAN-D]  (value not drawn)
C35  CAP-POLAR  [CAP-TAN-D]  (value not drawn)
C36  CAP-NON-POLAR  [CAP-0805]  (value not drawn)
C37  CAP-NON-POLAR  [CAP-0805]  (value not drawn)
C47  CAP-NON-POLAR  [CAP-0805]  (value not drawn)
C48  CAP-POLAR  [CAPPOL-16x25]  (value not drawn)
C49  CAP-NON-POLAR  [CAP-0805]  (value not drawn)
C50  CAP-POLAR  [CAPPOL-16x25]  (value not drawn)
C51  CAP-POLAR  [CAP-TAN-D]  (value not drawn)
C52  CAP-POLAR  [CAP-TAN-D]  (value not drawn)
C53  CAP-NON-POLAR  [CAP-0805]  (value not drawn)
C54  CAP-NON-POLAR  [CAP-0805]  (value not drawn)
C55  CAP-NON-POLAR  [CAP-0805]  (value not drawn)
C56  CAP-NON-POLAR  [CAP-0805]  (value not drawn)
C60  CAP-NON-POLAR  [CAP-0805]  (value not drawn)
C61  CAP-NON-POLAR  [CAP-0805]  (value not drawn)
C64  CAP-NON-POLAR  [CAP-0805]  (value not drawn)
C65  CAP-POLAR  [CAPPOL-16x25]  (value not drawn)
C66  CAP-NON-POLAR  [CAP-0805]  (value not drawn)
C67  CAP-POLAR  [CAPPOL-16x25]  (value not drawn)
C68  CAP-NON-POLAR  [CAP-0805]  (value not drawn)
C69  CAP-POLAR  [CAP-TAN-D]  (value not drawn)
C70  CAP-NON-POLAR  [CAP-0805]  (value not drawn)
C71  CAP-NON-POLAR  [CAP-0805]  (value not drawn)
C72  CAP-POLAR  [CAP-TAN-D]  (value not drawn)
C73  CAP-NON-POLAR  [CAP-0805]  (value not drawn)
C74  CAP-NON-POLAR  [CAP-0805]  (value not drawn)
C77  CAP-NON-POLAR  [CAP-0805]  (value not drawn)
C78  CAP-POLAR  [CAPPOL-16x25]  (value not drawn)
C79  CAP-NON-POLAR  [CAP-0805]  (value not drawn)
C80  CAP-POLAR  [CAPPOL-16x25]  (value not drawn)
C81  CAP-POLAR  [CAP-TAN-D]  (value not drawn)
C82  CAP-POLAR  [CAP-TAN-D]  (value not drawn)
C83  CAP-NON-POLAR  [CAP-0805]  (value not drawn)
C84  CAP-NON-POLAR  [CAP-0805]  (value not drawn)
C86  1000pF  [CAP-1206]
C93  CAP-NON-POLAR  [CAP-0805]  (value not drawn)
C94  CAP-NON-POLAR  [CAP-0805]  (value not drawn)
C95  CAP-NON-POLAR  [CAP-0805]  (value not drawn)
C96  2.2nF  [CAP-0805]
C99  CAP-NON-POLAR  [CAP-0805]  (value not drawn)
C100  CAP-POLAR  [CAPPOL-16x25]  (value not drawn)
C101  CAP-NON-POLAR  [CAP-0805]  (value not drawn)
C102  CAP-NON-POLAR  [CAP-0805]  (value not drawn)
C103  CAP-POLAR  [CAPPOL-16x25]  (value not drawn)
C104  CAP-NON-POLAR  [CAP-0805]  (value not drawn)
C105  CAP-NON-POLAR  [CAP-0805]  (value not drawn)
C106  CAP-POLAR  [CAP-TAN-D]  (value not drawn)
C107  CAP-POLAR  [CAP-TAN-D]  (value not drawn)
C108  CAP-NON-POLAR  [CAP-0805]  (value not drawn)
C109  CAP-NON-POLAR  [CAP-0805]  (value not drawn)
C112  CAP-NON-POLAR  [CAP-0805]  (value not drawn)
C113  CAP-POLAR  [CAPPOL-16x25]  (value not drawn)
C114  CAP-NON-POLAR  [CAP-0805]  (value not drawn)
C115  CAP-POLAR  [CAPPOL-16x25]  (value not drawn)
C116  CAP-POLAR  [CAP-TAN-D]  (value not drawn)
C117  CAP-POLAR  [CAP-TAN-D]  (value not drawn)
C118  CAP-NON-POLAR  [CAP-0805]  (value not drawn)
C119  CAP-NON-POLAR  [CAP-0805]  (value not drawn)
C120  CAP-NON-POLAR  [CAP-0805]  (value not drawn)
C121  CAP-NON-POLAR  [CAP-0805]  (value not drawn)
C123  CAP-NON-POLAR  [CAP-0805]  (value not drawn)
C125  CAP-NON-POLAR  [CAP-0805]  (value not drawn)
C126  CAP-NON-POLAR  [CAP-0805]  (value not drawn)
C127  CAP-NON-POLAR  [CAP-0805]  (value not drawn)
C128  CAP-POLAR  [CAPPOL-16x25]  (value not drawn)
C129  CAP-NON-POLAR  [CAP-0805]  (value not drawn)
C130  CAP-POLAR  [CAPPOL-16x25]  (value not drawn)
C131  CAP-NON-POLAR  [CAP-0805]  (value not drawn)
C132  CAP-NON-POLAR  [CAP-0805]  (value not drawn)
C133  CAP-POLAR  [CAP-TAN-D]  (value not drawn)
C134  CAP-POLAR  [CAP-TAN-D]  (value not drawn)
C135  CAP-NON-POLAR  [CAP-0805]  (value not drawn)
C136  CAP-NON-POLAR  [CAP-0805]  (value not drawn)
C?#1  330pF  [CAP-0805]
C?#2  330pF  [CAP-0805]
C?#3  330pF  [CAP-0805]
C?#4  330pF  [CAP-0805]
C?#5  C0805C224K5RACTU  [FP-C0805C-DN-MFG]
C?#6  4,7uF_630V  [CAP_4.7uF_630V]
C?#7  550V_470uF  [500V_470uF]
C?#8  4,7uF_630V  [CAP_4.7uF_630V]
C?#9  550V_470uF  [500V_470uF]
C?#10  550V_470uF  [500V_470uF]
C?#11  C0805C224K5RACTU  [FP-C0805C-DN-MFG]
C?#12  550V_470uF  [500V_470uF]
C?#13  4,7uF_630V  [CAP_4.7uF_630V]
C?#14  550V_470uF  [500V_470uF]
C?#15  550V_470uF  [500V_470uF]
C?#16  4,7uF_630V  [CAP_4.7uF_630V]
C?#17  550V_470uF  [500V_470uF]
C?#18  4,7uF_630V  [CAP_4.7uF_630V]
C?#19  550V_470uF  [500V_470uF]
C?#20  550V_470uF  [500V_470uF]
C?#21  4,7uF_630V  [CAP_4.7uF_630V]
C?#22  1uF  [CAP-0805]
C?#23  2.2uF  [FP-C0805C-DN-MFG]
C?#24  1uF  [CAP-0805]
C?#25  2.2uF  [FP-C0805C-DN-MFG]
C?#26  0.1uF  [CAP-0805]
C?#27  0.1uF  [CAP-0805]
C?#28  0.1uF  [CAP-0805]
C?#29  1000pF  [CAP-0805]
C?#30  0.1uF  [CAP-0805]
C?#31  0.1uF  [CAP-0805]
C?#32  47uF_16V  [CAP-TAN-D]
C?#33  0.1uF  [CAP-0805]
C?#34  CAP-POLAR  [SIZE_EEE]  (value not drawn)
C?#35  CAP-NON-POLAR  [CAP-0805]  (value not drawn)
C?#36  CAP-POLAR  [SIZE_EEE]  (value not drawn)
C?#37  0.1uF  [CAP-0805]
C?#38  CAP-POLAR  [SIZE_EEE]  (value not drawn)
C?#39  0.1uF  [CAP-0805]
C?#40  CAP-POLAR  [SIZE_EEE]  (value not drawn)
C?#41  0.1uF  [CAP-0805]
C?#42  CAP-POLAR  [CAP-TAN-D]  (value not drawn)
C?#43  0.1uF  [CAP-0805]
C?#44  220pF  [CAP-0805]
C?#45  0.1uF  [CAP-0805]
C?#46  CAP-POLAR  [SIZE_EEE]  (value not drawn)
C?#47  0.1uF  [CAP-0805]
C?#48  CAP-POLAR  [SIZE_EEE]  (value not drawn)
C?#49  0.1uF  [CAP-0805]
C?#50  0.1uF  [CAP-0805]
C?#51  CAP-POLAR  [SIZE_EEE]  (value not drawn)
C?#52  0.1uF  [CAP-0805]
C?#53  CAP-POLAR  [SIZE_EEE]  (value not drawn)
C?#54  0.1uF  [CAP-0805]
C?#55  CAP-POLAR  [SIZE_EEE]  (value not drawn)
C?#56  0.1uF  [CAP-0805]
C?#57  220pF  [CAP-0805]
C?#58  25V 2200uF  [CAPPOL-12x25]
C?#59  25V 2200uF  [CAPPOL-12x25]
C?#60  1000pF  [CAP-1206]
C?#61  1000uF_10V  [1000uF_10V_Size_F]
C?#62  0.1uF  [CAP-0805]
C?#63  1000uF_10V  [1000uF_10V_Size_F]
C?#64  0.1uF  [CAP-0805]
C?#65  2200uF 25V  [CAPPOL-16x25]
C?#66  16pF  [FP-GRM21B-0_1-IPC_C]
C?#67  16pF  [FP-GRM21B-0_1-IPC_C]
C?#68  CAP-NON-POLAR  [CAP-0805]  (value not drawn)
C?#69  CAP-POLAR  [CAP-TAN-D]  (value not drawn)
C?#70  CAP-NON-POLAR  [CAP-0805]  (value not drawn)
C?#71  CAP-POLAR  [CAP-TAN-D]  (value not drawn)
C?#72  CAP-POLAR  [CAP-TAN-D]  (value not drawn)
C?#73  CAP-NON-POLAR  [CAP-0805]  (value not drawn)
C?#74  CAP-POLAR  [CAP-TAN-D]  (value not drawn)
C?#75  CAP-NON-POLAR  [CAP-0805]  (value not drawn)
C?#76  CAP-NON-POLAR  [CAP-0805]  (value not drawn)
C?#77  CAP-POLAR  [CAP-TAN-D]  (value not drawn)
C?#78  CAP-NON-POLAR  [CAP-0805]  (value not drawn)
C?#79  CAP-POLAR  [CAP-TAN-D]  (value not drawn)
C?#80  CAP-NON-POLAR  [CAP-0805]  (value not drawn)
C?#81  CAP-POLAR  [CAP-TAN-D]  (value not drawn)
C?#82  CAP-NON-POLAR  [CAP-0805]  (value not drawn)
C?#83  CAP-POLAR  [CAP-TAN-D]  (value not drawn)
C?#84  CAP-NON-POLAR  [CAP-0805]  (value not drawn)
C?#85  CAP-POLAR  [CAP-TAN-D]  (value not drawn)
C?#86  CAP-NON-POLAR  [CAP-0805]  (value not drawn)
C?#87  CAP-POLAR  [CAP-TAN-D]  (value not drawn)
C?#88  CAP-NON-POLAR  [CAP-0805]  (value not drawn)
C?#89  CAP-POLAR  [CAP-TAN-D]  (value not drawn)
C?#90  CAP-NON-POLAR  [CAP-0805]  (value not drawn)
C?#91  CAP-POLAR  [CAP-TAN-D]  (value not drawn)
C?#92  CAP-NON-POLAR  [CAP-0805]  (value not drawn)
C?#93  CAP-POLAR  [CAP-TAN-D]  (value not drawn)
C?#94  CAP-NON-POLAR  [CAP-0805]  (value not drawn)
C?#95  CAP-POLAR  [CAP-TAN-D]  (value not drawn)
C?#96  CAP-NON-POLAR  [CAP-0805]  (value not drawn)
C?#97  CAP-POLAR  [CAP-TAN-D]  (value not drawn)
D1  US1G  [US1G_SMA]  (value not drawn)
D2  US1G  [US1G_SMA]  (value not drawn)
D3  US1G  [US1G_SMA]  (value not drawn)
D4  US1G  [US1G_SMA]  (value not drawn)
D5  US1G  [US1G_SMA]  (value not drawn)
D6  US1G  [US1G_SMA]  (value not drawn)
D7  US1G  [US1G_SMA]  (value not drawn)
D8  US1G  [US1G_SMA]  (value not drawn)
D9  US1G  [US1G_SMA]  (value not drawn)
D10  US1G  [US1G_SMA]  (value not drawn)
D11  US1G  [US1G_SMA]  (value not drawn)
D12  US1G  [US1G_SMA]  (value not drawn)
D13  US1G  [US1G_SMA]  (value not drawn)
D14  US1G  [US1G_SMA]  (value not drawn)
D15  US1G  [US1G_SMA]  (value not drawn)
D16  US1G  [US1G_SMA]  (value not drawn)
D30  151031YS06000  [LED_GREEN]
D31  151031YS06000  [LED_Yellow]
D32  BZX85C15-TAP  [FP-6_561-5001_02-4-MFG]
D?#1  151031YS06000  [LED_RED]
D?#2  151031YS06000  [LED_BLUE]
D?#3  151031YS06000  [LED_GREEN]
D?#4  151031YS06000  [LED_RED]
D?#5  LED  [LED_BLUE]
D?#6  151031YS06000  [LED_RED]
D?#7  151031YS06000  [LED_GREEN]
J1  691101710002  [691101710002]  (value not drawn)
J2  691101710002  [691101710002]  (value not drawn)
J4  691101710002  [691101710002]  (value not drawn)
J6  SWR25X-NRTC-S06-ST-BA  [Sullins_SWR25X-NRTC-S06-ST-BA_MFG]  (value not drawn)
J7  SWR25X-NRTC-S06-ST-BA  [Sullins_SWR25X-NRTC-S06-ST-BA_MFG]  (value not drawn)
J8  G  [Klema_PCB_15A]
J9  G(4)  [Klema_PCB_15A]
J10  E  [Klema_PCB_15A]
J11  SWR25X-NRTC-S06-ST-BA  [Sullins_SWR25X-NRTC-S06-ST-BA_MFG]  (value not drawn)
J12  Jumper 1x2.54  [Jumper_2.54]  (value not drawn)
J13  691101710002  [691101710002]  (value not drawn)
J14  E(5)  [Klema_PCB_15A]
J15  100A  [Klema_100A]
J16  G  [Klema_PCB_15A]
J17  G(6)  [Klema_PCB_15A]
J18  E  [Klema_PCB_15A]
J19  E(7)  [Klema_PCB_15A]
J20  G  [Klema_PCB_15A]
J21  G  [Klema_PCB_15A]
J22  E  [Klema_PCB_15A]
J23  E  [Klema_PCB_15A]
J24  G  [Klema_PCB_15A]
J25  G  [Klema_PCB_15A]
J26  100A  [Klema_100A]
J27  E  [Klema_PCB_15A]
J28  E  [Klema_PCB_15A]
J29  G  [Klema_PCB_15A]
J30  G  [Klema_PCB_15A]
J31  E  [Klema_PCB_15A]
J32  E  [Klema_PCB_15A]
J33  G  [Klema_PCB_15A]
J34  100A  [Klema_100A]
J35  G  [Klema_PCB_15A]
J36  E  [Klema_PCB_15A]
J37  E  [Klema_PCB_15A]
J38  G  [Klema_PCB_15A]
J39  G  [Klema_PCB_15A]
J40  E  [Klema_PCB_15A]
J41  E  [Klema_PCB_15A]
J42  100A  [Klema_100A]
J43  G  [Klema_PCB_15A]
J44  G  [Klema_PCB_15A]
J45  E  [Klema_PCB_15A]
J46  E  [Klema_PCB_15A]
J?#1  100A  [Klema_100A]
J?#2  100A  [Klema_100A]
J?#3  100A  [Klema_100A]
J?#4  100A  [Klema_100A]
J?#5  TL-800  [Conn_Tianli_T-800]  (value not drawn)
J?#6  (no value)  [691101710003]
J?#7  691101710002  [691101710002]  (value not drawn)
L1  744776227  [WE-PD2_1054]
L2  Coil  [Coil_drosel]  (value not drawn)
L6  744776227  [WE-PD2_1054]
L8  744776227  [WE-PD2_1054]
L?#1  Coil  [Coil_drosel]  (value not drawn)
L?#2  1000µH, 0.3A  [WE-PD2_7850]  (value not drawn)
L?#3  1000µH, 0.3A  [WE-PD2_7850]  (value not drawn)
L?#4  744776227  [WE-PD2_1054]
L?#5  1000µH, 0.3A  [WE-PD2_7850]  (value not drawn)
P1  TSW-104-08-G-S  [SMTC-TSW-104-08-X-S]
P4  61900311121  [61900311121]
P12  61300511121  [61300511121]  (value not drawn)
P13  61300511121  [61300511121]  (value not drawn)
P14  61300511121  [61300511121]  (value not drawn)
P?#1  61900311121  [61900311121]
P?#2  61900311121  [61900311121]
P?#3  61900311121  [61900311121]
P?#4  61900211121  [61900211121]
P?#5  61900311121  [61900311121]
Q?#1  BC847C  [INF-SOT23_N]
Q?#2  BC847C  [INF-SOT23_N]
Q?#3  BC847C  [INF-SOT23_N]
Q?#4  BC847C  [INF-SOT23_N]
R6  10  [RES-2512]
R7  10  [RES-2512]
R11  10K  [RES-0805]
R12  1K  [RES-2512]
R13  10K  [RES-0805]
R14  1K  [RES-2512]
R15  100K  [RES-0805]
R16  10K  [RES-0805]
R17  100K  [RES-0805]
R18  10K  [RES-0805]
R19  10  [RES-2512]
R21  10  [RES-2512]
R23  1K  [RES-0805]
R24  1K  [RES-0805]
R25  10K  [RES-0805]
R26  1K  [RES-2512]
R27  10K  [RES-0805]
R28  1K  [RES-2512]
R29  10K  [RES-0805]
R30  10  [RES-2512]
R31  10  [RES-2512]
R32  10K  [RES-0805]
R33  1K  [RES-2512]
R34  10K  [RES-0805]
R35  1K  [RES-2512]
R36  100K  [RES-0805]
R37  10K  [RES-0805]
R40  100K  [RES-0805]
R41  10K  [RES-0805]
R42  10  [RES-2512]
R43  10  [RES-2512]
R44  10K  [RES-0805]
R45  1K  [RES-2512]
R46  10K  [RES-0805]
R47  1K  [RES-2512]
R48  1K  [RES-0805]
R49  1K  [RES-0805]
R50  10K  [RES-0805]
R51  10  [RES-2512]
R52  10  [RES-2512]
R58  10K  [Yageo_RC0805_IPC_C]
R59  10K  [RES-0805]
R60  1K  [RES-2512]
R61  10K  [Yageo_RC0805_IPC_C]
R62  10K  [RES-0805]
R63  1K  [RES-2512]
R64  100K  [RES-0805]
R65  10K  [RES-0805]
R66  20K  [RES-0805]
R67  10K  [RES-0805]
R68  10  [RES-2512]
R69  10  [RES-2512]
R70  10K  [RES-0805]
R71  1K  [RES-2512]
R72  10K  [RES-0805]
R73  1K  [RES-2512]
R74  1K  [RES-0805]
R75  1K  [RES-0805]
R76  10K  [RES-0805]
R77  10  [RES-2512]
R78  10  [RES-2512]
R79  10K  [RES-0805]
R80  1K  [RES-2512]
R81  10K  [RES-0805]
R82  1K  [RES-2512]
R83  100K  [RES-0805]
R84  10K  [RES-0805]
R85  100K  [RES-0805]
R86  10K  [RES-0805]
R87  10  [RES-2512]
R88  10  [RES-2512]
R89  10K  [RES-0805]
R90  1K  [RES-2512]
R91  1K  [RES-0805]
R92  1K  [RES-0805]
R93  10K  [RES-0805]
R94  1K  [RES-2512]
R95  10K  [RES-0805]
R113  220  [RES-0805]
R?#1  10K  [RES-0805]
R?#2  10K  [RES-0805]
R?#3  10K  [RES-0805]
R?#4  10K  [RES-0805]
R?#5  220  [RES-0805]
R?#6  220  [RES-0805]
R?#7  220  [RES-0805]
R?#8  220  [RES-0805]
R?#9  220  [RES-0805]
R?#10  10K  [RES-0805]
R?#11  10K  [RES-0805]
R?#12  10K  [RES-0805]
R?#13  47K  [RES-0805]
R?#14  330K  [RES-2512]
R?#15  100K  [RES-2W]
R?#16  100K  [RES-2W]
R?#17  330K  [RES-2512]
R?#18  330K  [RES-2512]
R?#19  100K  [RES-2W]
R?#20  100K  [RES-2W]
R?#21  330K  [RES-2512]
R?#22  10K  [RES-0805]
R?#23  10K  [RES-0805]
R?#24  10K  [RES-0805]
R?#25  10K  [RES-0805]
R?#26  10K  [RES-0805]
R?#27  RC0805FR-07100KL  [Yageo_RC0805_IPC_A]
R?#28  100  [RES-0805]
R?#29  330K  [RES-2512]
R?#30  1K  [RES-0805]
R?#31  330K  [RES-2512]
R?#32  100K  [RES-2W]
R?#33  100K  [RES-2W]
R?#34  100  [RES-0805]
R?#35  100K  [RES-0805]
R?#36  RC0805FR-07100KL  [Yageo_RC0805_IPC_A]
R?#37  10K  [RES-0805]
R?#38  220  [RES-0805]
R?#39  10K  [RES-0805]
R?#40  10K  [RES-0805]
R?#41  20K  [Yageo_RC0805_IPC_A]
R?#42  1K  [RES-0805]
R?#43  20K  [RES-0805]
R?#44  20K  [RES-0805]
R?#45  3K  [RES-2512]
R?#46  100K  [RES-0805]
R?#47  30K  [RES-0805]
R?#48  30K  [RES-0805]
R?#49  10K  [RES-0805]
R?#50  1K  [RES-0805]
R?#51  10K  [RES-0805]
R?#52  47K  [RES-0805]
R?#53  10K  [RES-0805]
R?#54  220  [RES-0805]
R?#55  10K  [RES-0805]
R?#56  10K  [RES-0805]
R?#57  10K  [RES-0805]
R?#58  10K  [RES-0805]
R?#59  10K  [RES-0805]
R?#60  10K  [RES-0805]
R?#61  10K  [RES-0805]
R?#62  10K  [RES-0805]
R?#63  3K  [RES-0805]
R?#64  1K  [RES-0805]
R?#65  10K  [RES-0805]
R?#66  10K  [RES-0805]
R?#67  10K  [RES-0805]
R?#68  10K  [RES-0805]
R?#69  10K  [RES-0805]
R?#70  10K  [RES-0805]
R?#71  10K  [RES-0805]
R?#72  3K  [RES-0805]
R?#73  1K  [RES-0805]
R?#74  10K  [RES-0805]
R?#75  10K  [RES-0805]
R?#76  10K  [RES-0805]
R?#77  10K  [RES-0805]
R?#78  10K  [RES-0805]
R?#79  10K  [RES-0805]
R?#80  10K  [RES-0805]
R?#81  3K  [RES-0805]
R?#82  1K  [RES-0805]
R?#83  10K  [RES-0805]
R?#84  3K  [RES-0805]
R?#85  1K  [RES-0805]
R?#86  10K  [RES-0805]
R?#87  10K  [RES-0805]
R?#88  10K  [RES-0805]
R?#89  10K  [RES-0805]
R?#90  10K  [RES-0805]
R?#91  10K  [RES-0805]
R?#92  10K  [RES-0805]
RG?  LM7805CT  [TO-220_Bended_Rad]
TP56  (no value)  [Test_Point]
TP88  Test_Point_PCB  [Test_Point]  (value not drawn)
TP89  Test_Point_PCB  [Test_Point]  (value not drawn)
TP?#1  (no value)  [Test_Point]
TP?#2  (no value)  [Test_Point]
TP?#3  (no value)  [Test_Point]
TP?#4  Test_Point_PCB  [Test_Point]  (value not drawn)
TP?#5  (no value)  [Test_Point]
TP?#6  Test_Point_PCB  [Test_Point]  (value not drawn)
TP?#7  (no value)  [Test_Point]
TP?#8  Test_Point_PCB  [Test_Point]  (value not drawn)
TP?#9  Test_Point_PCB  [Test_Point]  (value not drawn)
TP?#10  Test_Point_PCB  [Test_Point]  (value not drawn)
TP?#11  Test_Point_PCB  [Test_Point]  (value not drawn)
TP?#12  (no value)  [Test_Point]
TP?#13  Test_Point_PCB  [Test_Point]  (value not drawn)
TP?#14  (no value)  [Test_Point]
TP?#15  Test_Point_PCB  [Test_Point]  (value not drawn)
TP?#16  Test_Point_PCB  [Test_Point]  (value not drawn)
TP?#17  Test_Point_PCB  [Test_Point]  (value not drawn)
TP?#18  (no value)  [Test_Point]
TP?#19  (no value)  [Test_Point]
TP?#20  (no value)  [Test_Point]
TP?#21  Test_Point_PCB  [Test_Point]  (value not drawn)
TP?#22  Test_Point_PCB  [Test_Point]  (value not drawn)
TP?#23  Test_Point_PCB  [Test_Point]  (value not drawn)
U5  UCC21520DW  [FP-DW0016B-MFG]
U6  UCC21520DW  [FP-DW0016B-MFG]
U7  74LVC1G14  [SOT23-5_N]  (value not drawn)  (parts A,B of 2)
U8  ACS758  [ACS758-100]  (value not drawn)
U10  UCC21520DW  [FP-DW0016B-MFG]
U11  UCC21520DW  [FP-DW0016B-MFG]
U14  ACS758  [ACS758-100]  (value not drawn)
U16  UCC21520DW  [FP-DW0016B-MFG]
U17  UCC21520DW  [FP-DW0016B-MFG]
U20  ACS758  [ACS758-100]  (value not drawn)
U22  UCC21520DW  [FP-DW0016B-MFG]
U23  UCC21520DW  [FP-DW0016B-MFG]
U25  ACS758  [ACS758-100]  (value not drawn)
U?#1  B0505S-1W  [B0505S-1W]
U?#2  (no value)  [ACS758-100]
U?#3  ADUM1401BRWZ  [ADI-RW-16_M]
U?#4  MAX485  [SOIC-8-MFG]
U?#5  (no value)  [SOT-23-5]
U?#6  AMC1311  [FP-DWV0008A-MFG]
U?#7  AMS1117-3v3  [SOT-223-3]
U?#8  B0505S-1W  [B0505S-1W]
U?#9  AMS1117-3v3  [SOT-223-3]
U?#10  AMS1117-3v3  [SOT-223-3]
U?#11  STM32F303RBT6  [LQFP64-10x10mm]
U?#12  74LVC1G14  [SOT23-5_N]  (value not drawn)  (part A of 2)
U?#13  74LVC1G14  [SOT23-5_N]  (value not drawn)  (part A of 2)
U?#14  74LVC1G14  [SOT23-5_N]  (value not drawn)  (part A of 2)
U?#15  74LVC1G14  [SOT23-5_N]  (value not drawn)  (part B of 2)
U?#16  74LVC1G14  [SOT23-5_N]  (value not drawn)  (part B of 2)
U?#17  74LVC1G14  [SOT23-5_N]  (value not drawn)  (part B of 2)
U?#18  74LVC1G14  [SOT23-5_N]  (value not drawn)  (part A of 2)
U?#19  74LVC1G14  [SOT23-5_N]  (value not drawn)  (part A of 2)
U?#20  74LVC1G14  [SOT23-5_N]  (value not drawn)  (part A of 2)
U?#21  74LVC1G14  [SOT23-5_N]  (value not drawn)  (part A of 2)
U?#22  74LVC1G14  [SOT23-5_N]  (value not drawn)  (part B of 2)
U?#23  74LVC1G14  [SOT23-5_N]  (value not drawn)  (part B of 2)
U?#24  74LVC1G14  [SOT23-5_N]  (value not drawn)  (part B of 2)
U?#25  74LVC1G14  [SOT23-5_N]  (value not drawn)  (part B of 2)
U?#26  74LVC1G14  [SOT23-5_N]  (value not drawn)  (part A of 2)
U?#27  74LVC1G14  [SOT23-5_N]  (value not drawn)  (part A of 2)
U?#28  74LVC1G14  [SOT23-5_N]  (value not drawn)  (part A of 2)
U?#29  74LVC1G14  [SOT23-5_N]  (value not drawn)  (part A of 2)
U?#30  74LVC1G14  [SOT23-5_N]  (value not drawn)  (part B of 2)
U?#31  74LVC1G14  [SOT23-5_N]  (value not drawn)  (part B of 2)
U?#32  74LVC1G14  [SOT23-5_N]  (value not drawn)  (part B of 2)
U?#33  74LVC1G14  [SOT23-5_N]  (value not drawn)  (part B of 2)
U?#34  74LVC1G14  [SOT23-5_N]  (value not drawn)  (part A of 2)
U?#35  74LVC1G14  [SOT23-5_N]  (value not drawn)  (part A of 2)
U?#36  74LVC1G14  [SOT23-5_N]  (value not drawn)  (part A of 2)
U?#37  74LVC1G14  [SOT23-5_N]  (value not drawn)  (part A of 2)
U?#38  74LVC1G14  [SOT23-5_N]  (value not drawn)  (part B of 2)
U?#39  74LVC1G14  [SOT23-5_N]  (value not drawn)  (part B of 2)
U?#40  74LVC1G14  [SOT23-5_N]  (value not drawn)  (part B of 2)
U?#41  74LVC1G14  [SOT23-5_N]  (value not drawn)  (part B of 2)
VD1  5.1V  [DO-35]
VD2  5.1V  [DO-35]
VD3  5.1V  [DO-35]
VD4  5.1V  [DO-35]
VD5  5.1V  [DO-35]
VD6  5.1V  [DO-35]
VD7  5.1V  [DO-35]
VD8  5.1V  [DO-35]
VD9  5.1V  [DO-35]
VD10  5.1V  [DO-35]
VD11  5.1V  [DO-35]
VD12  5.1V  [DO-35]
VD13  5.1V  [DO-35]
VD14  5.1V  [DO-35]
VD15  5.1V  [DO-35]
VD16  5.1V  [DO-35]
VD?  15V  [DO-017AA]
Y?  FOXSLF/120-20  [FOX-FOXSLF-2_V]
ZD4  P6SMB16CA  [DO-214AA]  (value not drawn)
ZD?#1  P6SMB16CA  [DO-214AA]  (value not drawn)
ZD?#2  P6SMB16CA  [DO-214AA]  (value not drawn)

## Ports
ADC_1, ADC_2, BOOT (bidir), CLEAR, CS_1, CS_2, CS_3, DIRECT, DIRECT (bidir), DISP_INT, DISP_LED, DISP_RST, HALL_A, HALL_B, HALL_C, INP_1, LED_1, LED_2, LED_3, LED_4, LED_5, LED_6, MISO, MOSI, OUT_N1, OUT_P1, PORT_1, PORT_1_DIS, PORT_2, PORT_2_DIS, PORT_3, PORT_3_DIS, PORT_4, PORT_4_DIS, PWM_1_1, PWM_1_1_INV, PWM_1_1_STR, PWM_1_2, PWM_1_2_INV, PWM_1_2_STR, PWM_2_1, PWM_2_1_INV, PWM_2_1_STR, PWM_2_2, PWM_2_2_INV, PWM_2_2_STR, PWM_3_1, PWM_3_1_INV, PWM_3_1_STR, PWM_3_2, PWM_3_2_INV, PWM_3_2_STR, PWM_4_1, PWM_4_1_INV, PWM_4_1_STR, PWM_4_2, PWM_4_2_INV, PWM_4_2_STR, RESET (bidir), RX, RX (bidir), RX_1, RX_1 (bidir), SCK, SCL (bidir), SDA (bidir), SENS_1, SENS_2, SENS_3, SENS_4, START, STOP, SWCLC (bidir), SWDIO (bidir), TIME_in_1, TIME_in_2, TX, TX (bidir), TX_1, TX_1 (bidir), UI_INT

## Nets
+3V3: C?#26.2 C?#55.1(+) C?#56.2 J6.1 J7.1 J11.1 L?#5.2 P1.1 P12.4 P14.4 R58.1 R61.1 R?#23.2 R?#24.2 TP?#7.1(G9) U?#5.5(VDD)
+3V3_MCU: C?#40.1(+) C?#41.2 L?#2.2 R?#55.2 U?#11.1(VBAT) U?#11.19(VDD) U?#11.32(VDD) U?#11.48(VDD) U?#11.64(VDD)
+3V3_REF: C?#48.1(+) C?#49.2 L?#3.2 R?#54.2 U?#11.13(VDDA/VREF+)
+5: C20.2 C21.1(+) C?#31.1 C?#32.1(+) C?#36.1(+) C?#37.2 C?#45.2 C?#51.1(+) C?#52.2 C?#68.2 C?#69.1(+) C?#70.2 C?#71.1(+) C?#72.1(+) C?#73.2 C?#74.1(+) C?#75.2 C?#76.2 C?#77.1(+) C?#78.2 C?#79.1(+) C?#80.2 C?#81.1(+) C?#82.2 C?#83.1(+) C?#84.2 C?#85.1(+) C?#86.2 C?#87.1(+) C?#88.2 C?#89.1(+) C?#90.2 C?#91.1(+) C?#92.2 C?#93.1(+) C?#94.2 C?#95.1(+) C?#96.2 C?#97.1(+) R?#63.1 R?#72.1 R?#81.1 R?#84.1 U5.3(VCCI) U5.8(VCCI) U6.3(VCCI) U6.8(VCCI) U7.1(NC) U7.5(VCC) U10.3(VCCI) U10.8(VCCI) U11.3(VCCI) U11.8(VCCI) U16.3(VCCI) U16.8(VCCI) U17.3(VCCI) U17.8(VCCI) U22.3(VCCI) U22.8(VCCI) U23.3(VCCI) U23.8(VCCI) U?#6.8(VDD2) U?#7.3(VIN) U?#8.2(VIN) U?#9.3(VIN) U?#10.3(VIN) U?#15.1(NC) U?#15.5(VCC) U?#16.1(NC) U?#16.5(VCC) U?#17.1(NC) U?#17.5(VCC) U?#22.1(NC) U?#22.5(VCC) U?#23.1(NC) U?#23.5(VCC) U?#24.1(NC) U?#24.5(VCC) U?#25.1(NC) U?#25.5(VCC) U?#30.1(NC) U?#30.5(VCC) U?#31.1(NC) U?#31.5(VCC) U?#32.1(NC) U?#32.5(VCC) U?#33.1(NC) U?#33.5(VCC) U?#38.1(NC) U?#38.5(VCC) U?#39.1(NC) U?#39.5(VCC) U?#40.1(NC) U?#40.5(VCC) U?#41.1(NC) U?#41.5(VCC)
+5V: C?#5.1 C?#61.1(+) C?#64.2 J4.1 J6.2 J11.2 L1.2 L6.1 P12.5 P13.5 P14.5 U?#2.1(+VCC)
+5V_1: C26.2 C68.2 C101.2 C126.2 C?#62.2 C?#63.1(+) L1.1 P4.3 P?#1.3 P?#2.3 P?#3.3 P?#5.3 R?#1.2 RG?.3(Output) TP56.1(G9) U8.1(+VCC) U14.1(+VCC) U20.1(+VCC) U25.1(+VCC)
+5V_ISO: C?#11.1 R?#22.2 R?#25.2 R?#26.2 TP?#6.1(G9) U?#1.4(+Vo) U?#3.10(VE2) U?#3.16(VDD2) U?#4.8(VCC)
+5V_RS: C?#34.1(+) C?#35.2 L6.2 U?#1.2(VIN) U?#3.1(VDD1) U?#3.7(VE1)
+24V_1: C4.1(+) C7.2 C9.1(+) C11.2 C12.1(+) C47.2 C48.1(+) C49.2 C50.1(+) C77.2 C78.1(+) C79.2 C80.1(+) C86.2 C112.2 C113.1(+) C114.2 C115.1(+) L8.2 R12.2 R14.2 R33.2 R35.2 R60.2 R63.2 R80.2 R82.2 TP89.1(G9) U5.16(VDDA) U6.16(VDDA) U10.16(VDDA) U11.16(VDDA) U16.16(VDDA) U17.16(VDDA) U22.16(VDDA) U23.16(VDDA)
+24V_2: C27.2 C29.1(+) C30.2 C31.1(+) C64.2 C65.1(+) C66.2 C67.1(+) C99.2 C100.1(+) C102.2 C103.1(+) C127.2 C128.1(+) C129.2 C130.1(+) C?#59.1(+) C?#60.2 L?#4.2 R26.2 R28.2 R45.2 R47.2 R71.2 R73.2 R90.2 R94.2 TP?#23.1(G9) U5.11(VDDB) U6.11(VDDB) U10.11(VDDB) U11.11(VDDB) U16.11(VDDB) U17.11(VDDB) U22.11(VDDB) U23.11(VDDB)
GND: C20.1 C21.2(-) C22.1 C23.1 C24.1 C25.1 C26.1 C32.1 C33.1 C55.1 C56.1 C60.1 C61.1 C68.1 C70.1 C71.1 C93.1 C94.1 C95.1 C96.1 C101.1 C104.1 C105.1 C120.1 C121.1 C123.1 C125.1 C126.1 C131.1 C132.1 C?#1.1 C?#2.1 C?#3.1 C?#4.1 C?#5.2 C?#22.1 C?#23.1 C?#26.1 C?#29.1 C?#31.2 C?#32.2(-) C?#34.2(-) C?#35.1 C?#36.2(-) C?#37.1 C?#38.2(-) C?#39.1 C?#40.2(-) C?#41.1 C?#45.1 C?#46.2(-) C?#47.1 C?#48.2(-) C?#49.1 C?#50.1 C?#51.2(-) C?#52.1 C?#53.2(-) C?#54.1 C?#55.2(-) C?#56.1 C?#61.2(-) C?#62.1 C?#63.2(-) C?#64.1 C?#65.2(-) C?#66.2 C?#67.2 C?#68.1 C?#69.2(-) C?#70.1 C?#71.2(-) C?#72.2(-) C?#73.1 C?#74.2(-) C?#75.1 C?#76.1 C?#77.2(-) C?#78.1 C?#79.2(-) C?#80.1 C?#81.2(-) C?#82.1 C?#83.2(-) C?#84.1 C?#85.2(-) C?#86.1 C?#87.2(-) C?#88.1 C?#89.2(-) C?#90.1 C?#91.2(-) C?#92.1 C?#93.2(-) C?#94.1 C?#95.2(-) C?#96.1 C?#97.2(-) D30.2(K) D31.2(K) D32.2(A) D?#1.2(K) D?#2.2(K) D?#3.2(K) D?#4.2(K) D?#5.2(K) D?#7.2(K) J1.1 J4.2 J6.6 J7.6 J11.6 P1.4 P4.1 P12.1 P13.1 P14.1 P?#1.1 P?#2.1 P?#3.1 P?#4.1 P?#5.1 Q?#1.2(E) Q?#2.2(E) Q?#3.2(E) Q?#4.2(E) R15.1 R16.1 R17.1 R18.1 R29.2 R36.1 R37.1 R40.1 R41.1 R50.2 R64.1 R65.1 R66.1 R67.1 R76.2 R83.1 R84.1 R85.1 R86.1 R95.2 R?#10.2 R?#11.2 R?#12.2 R?#13.2 R?#35.2 R?#36.1 R?#39.1 R?#47.1 R?#48.1 R?#52.2 R?#56.1 R?#57.1 R?#58.1 R?#59.1 R?#60.1 R?#61.1 R?#62.1 R?#65.2 R?#66.1 R?#67.1 R?#68.1 R?#69.1 R?#70.1 R?#71.1 R?#74.2 R?#75.1 R?#76.1 R?#77.1 R?#78.1 R?#79.1 R?#80.1 R?#83.2 R?#86.2 R?#87.1 R?#88.1 R?#89.1 R?#90.1 R?#91.1 R?#92.1 RG?.2(GND) U5.4(GND) U6.4(GND) U7.3(GND) U8.2(GND) U10.4(GND) U11.4(GND) U14.2(GND) U16.4(GND) U17.4(GND) U20.2(GND) U22.4(GND) U23.4(GND) U25.2(GND) U?#1.1(GND) U?#2.2(GND) U?#3.2(GND1) U?#3.8(GND1) U?#5.2(VSS) U?#6.5(GND2) U?#7.1(Ground) U?#8.1(GND) U?#9.1(Ground) U?#10.1(Ground) U?#11.12(VSSA/VREF-) U?#11.31(VSS) U?#11.47(VSS) U?#11.63(VSS) U?#15.3(GND) U?#16.3(GND) U?#17.3(GND) U?#22.3(GND) U?#23.3(GND) U?#24.3(GND) U?#25.3(GND) U?#30.3(GND) U?#31.3(GND) U?#32.3(GND) U?#33.3(GND) U?#38.3(GND) U?#39.3(GND) U?#40.3(GND) U?#41.3(GND) ZD4.1(A)
GND_2: C?#11.2 J?#6.2 R?#37.1 R?#40.1 TP?#21.1(G9) U?#1.3(0V) U?#3.9(GND2) U?#3.15(GND2) U?#4.5(GND) ZD?#1.1(A) ZD?#2.1(A)
GND_-24V_1: C4.2(-) C5.2(-) C7.1 C9.2(-) C11.1 C12.2(-) C13.2(-) C14.2(-) C15.1 C16.1 C47.1 C48.2(-) C49.1 C50.2(-) C51.2(-) C52.2(-) C53.1 C54.1 C77.1 C78.2(-) C79.1 C80.2(-) C81.2(-) C82.2(-) C83.1 C84.1 C86.1 C112.1 C113.2(-) C114.1 C115.2(-) C116.2(-) C117.2(-) C118.1 C119.1 C?#44.1 J13.1 U5.14(VSSA) U6.14(VSSA) U10.14(VSSA) U11.14(VSSA) U16.14(VSSA) U17.14(VSSA) U22.14(VSSA) U23.14(VSSA) VD1.2(A) VD2.2(A) VD5.2(A) VD6.2(A) VD9.2(A) VD10.2(A) VD13.2(A) VD14.2(A)
GND_-24V_2: C27.1 C29.2(-) C30.1 C31.2(-) C34.2(-) C35.2(-) C36.1 C37.1 C64.1 C65.2(-) C66.1 C67.2(-) C69.2(-) C72.2(-) C73.1 C74.1 C99.1 C100.2(-) C102.1 C103.2(-) C106.2(-) C107.2(-) C108.1 C109.1 C127.1 C128.2(-) C129.1 C130.2(-) C133.2(-) C134.2(-) C135.1 C136.1 C?#57.1 C?#58.2(-) C?#59.2(-) C?#60.1 J?#7.1 U5.9(VSSB) U6.9(VSSB) U10.9(VSSB) U11.9(VSSB) U16.9(VSSB) U17.9(VSSB) U22.9(VSSB) U23.9(VSSB) VD3.2(A) VD4.2(A) VD7.2(A) VD8.2(A) VD11.2(A) VD12.2(A) VD15.2(A) VD16.2(A)
GND_HV: C?#17.2 C?#18.1 C?#19.2 C?#20.2 C?#21.1 C?#24.1 C?#25.1 C?#33.1 C?#42.2(-) C?#43.2 D?#6.2(K) J2.2 J?#5.1 R?#32.1 R?#33.1 R?#45.1 R?#46.2 U8.4(+IP) U14.4(+IP) U20.4(+IP) U25.4(+IP) U?#6.3(SHTDN) U?#6.4(GND1) U?#8.3(0V) VD?.2(A)
V_PS: C?#6.2 C?#9.1 J12.2 L?#1.1 R?#14.2 R?#15.2 R?#17.2 U?#2.5(-IP)
VCC: C?#65.1(+) D32.1(C) J1.2 RG?.1(Input) ZD4.2(A)
ADC_1: C?#22.2 R?#30.2 R?#35.1 TP?#12.1(G9) U?#11.18(PF4) ; port ADC_1
ADC_2: C?#29.2 R?#50.1 R?#52.1 U?#11.8(PC0) ; port ADC_2
BOOT: R?#56.2 ; port BOOT
CLEAR: J11.5 ; port CLEAR
CS_1: U?#11.26(PB0) ; port CS_1
CS_2: U?#11.27(PB1) ; port CS_2
CS_3: U?#11.28(PB2) ; port CS_3
DIRECT: J6.5 R?#38.2 R?#39.2 TP?#9.1(G9) U?#3.5(VIC) ; port DIRECT
DISP_INT: U?#11.11(PC3) ; port DISP_INT
DISP_LED: U?#11.39(PC8) ; port DISP_LED
DISP_RST: U?#11.38(PC7) ; port DISP_RST
HALL_A: C?#3.2 R?#2.2 R?#11.1 TP?#5.1(G9) U?#11.21(PA5) ; port HALL_A
HALL_B: C?#1.2 R?#3.2 R?#12.1 TP?#1.1(G9) U?#11.22(PA6) ; port HALL_B
HALL_C: C?#2.2 R?#4.2 R?#10.1 TP?#2.1(G9) U?#11.23(PA7) ; port HALL_C
INP_1: C?#24.2 R?#42.1 R?#46.1 TP?#18.1(G9) U?#6.2(VIN) ; port INP_1
LED_1: P13.4 R113.2 U?#11.30(PB11) ; port LED_1
LED_2: P13.3 R?#5.2 U?#11.33(PB12) ; port LED_2
LED_3: P13.2 R?#6.2 U?#11.34(PB13) ; port LED_3
LED_4: R?#7.2 U?#11.35(PB14) ; port LED_4
LED_5: R?#8.2 U?#11.52(PC11) ; port LED_5
LED_6: R?#9.2 U?#11.20(PA4) ; port LED_6
MISO: U?#11.56(PB4) ; port MISO
MOSI: U?#11.57(PB5) ; port MOSI
OUT_N1: C?#27.1 R?#51.1 U?#6.6(VOUTN) ; port OUT_N1
OUT_P1: C?#27.2 R?#49.1 U?#6.7(VOUTP) ; port OUT_P1
PORT_1: R?#64.1 U?#11.53(PC12) ; port PORT_1
PORT_1_DIS: C24.2 C60.2 Q?#1.3(C) R18.2 R41.2 R?#63.2 U6.5(DISABLE) U11.5(DISABLE) ; port PORT_1_DIS
PORT_2: R?#73.1 U?#11.2(PC13) ; port PORT_2
PORT_2_DIS: C95.2 C123.2 Q?#2.3(C) R67.2 R86.2 R?#72.2 U17.5(DISABLE) U23.5(DISABLE) ; port PORT_2_DIS
PORT_3: R?#82.1 U?#11.3(PC14/OSC32_IN) ; port PORT_3
PORT_3_DIS: C22.2 C55.2 Q?#3.3(C) R16.2 R37.2 R?#81.2 U5.5(DISABLE) U10.5(DISABLE) ; port PORT_3_DIS
PORT_4: R?#85.1 U?#11.4(PC15/OSC32_OUT) ; port PORT_4
PORT_4_DIS: C93.2 C120.2 Q?#4.3(C) R65.2 R84.2 R?#84.2 U16.5(DISABLE) U22.5(DISABLE) ; port PORT_4_DIS
PWM_1_1: R?#58.2 U7.2(A) U?#11.41(PA8) ; port PWM_1_1
PWM_1_1_INV: R?#61.2 U6.2(INB) U7.4(Y) U?#14.2(A) ; port PWM_1_1_INV
PWM_1_1_STR: R?#62.2 U6.1(INA) U?#14.4(Y) ; port PWM_1_1_STR
PWM_1_2: R?#66.2 U?#11.44(PA11) U?#19.2(A) ; port PWM_1_2
PWM_1_2_INV: R?#68.2 U11.2(INB) U?#18.2(A) U?#19.4(Y) ; port PWM_1_2_INV
PWM_1_2_STR: R?#69.2 U11.1(INA) U?#18.4(Y) ; port PWM_1_2_STR
PWM_2_1: R?#75.2 U?#11.42(PA9) U?#27.2(A) ; port PWM_2_1
PWM_2_1_INV: R?#77.2 U17.2(INB) U?#26.2(A) U?#27.4(Y) ; port PWM_2_1_INV
PWM_2_1_STR: R?#78.2 U17.1(INA) U?#26.4(Y) ; port PWM_2_1_STR
PWM_2_2: R?#87.2 U?#11.45(PA12) U?#34.2(A) ; port PWM_2_2
PWM_2_2_INV: R?#89.2 U23.2(INB) U?#34.4(Y) U?#35.2(A) ; port PWM_2_2_INV
PWM_2_2_STR: R?#90.2 U23.1(INA) U?#35.4(Y) ; port PWM_2_2_STR
PWM_3_1: R?#57.2 U?#11.43(PA10) U?#12.2(A) ; port PWM_3_1
PWM_3_1_INV: R?#60.2 U5.2(INB) U?#12.4(Y) U?#13.2(A) ; port PWM_3_1_INV
PWM_3_1_STR: R?#59.2 U5.1(INA) U?#13.4(Y) ; port PWM_3_1_STR
PWM_3_2: R?#67.2 U?#11.36(PB15) U?#20.2(A) ; port PWM_3_2
PWM_3_2_INV: R?#70.2 U10.2(INB) U?#20.4(Y) U?#21.2(A) ; port PWM_3_2_INV
PWM_3_2_STR: R?#71.2 U10.1(INA) U?#21.4(Y) ; port PWM_3_2_STR
PWM_4_1: R?#76.2 U?#11.37(PC6) U?#28.2(A) ; port PWM_4_1
PWM_4_1_INV: R?#79.2 U16.2(INB) U?#28.4(Y) U?#29.2(A) ; port PWM_4_1_INV
PWM_4_1_STR: R?#80.2 U16.1(INA) U?#29.4(Y) ; port PWM_4_1_STR
PWM_4_2: R?#88.2 U?#11.51(PC10) U?#36.2(A) ; port PWM_4_2
PWM_4_2_INV: R?#91.2 U22.2(INB) U?#36.4(Y) U?#37.2(A) ; port PWM_4_2_INV
PWM_4_2_STR: R?#92.2 U22.1(INA) U?#37.4(Y) ; port PWM_4_2_STR
RESET: C?#50.2 R?#55.1 ; port RESET
RX: J6.3 R?#23.1 TP?#16.1(G9) U?#3.6(VOD) ; port RX
RX_1: J7.5 U?#11.59(PB7) ; port RX_1
SCK: U?#11.55(PB3) ; port SCK
SCL: P12.2 P14.2 R61.2 U?#11.61(PB8) ; port SCL
SDA: P12.3 P14.3 R58.2 U?#11.62(PB9) ; port SDA
SENS_1: C32.2 R23.2 R29.1 U?#11.14(PA0) ; port SENS_1
SENS_2: C70.2 R48.2 R50.1 U?#11.15(PA1) ; port SENS_2
SENS_3: C104.2 R74.2 R76.1 U?#11.16(PA2) ; port SENS_3
SENS_4: C131.2 R91.2 R95.1 U?#11.17(PA3) ; port SENS_4
START: J11.3 ; port START
STOP: J11.4 ; port STOP
SWCLC: J7.3 P1.3 U?#11.49(PA14) ; port SWCLC
SWDIO: J7.2 P1.2 U?#11.46(PA13) ; port SWDIO
TIME_in_1: R?#43.2 R?#47.2 TP?#20.1(G9) U?#11.50(PA15) ; port TIME_in_1
TIME_in_2: R?#44.2 R?#48.2 TP?#19.1(G9) U?#11.29(PB10) ; port TIME_in_2
TX: J6.4 R?#24.1 TP?#10.1(G9) U?#3.4(VIB) ; port TX
TX_1: J7.4 U?#11.58(PB6) ; port TX_1
UI_INT: C?#4.2 P?#4.2 R?#1.1 R?#13.1 TP?#3.1(G9) U?#11.24(PC4) ; port UI_INT
NetC5_1: C5.1(+) C?#44.2 J13.2 L8.1 TP88.1(G9)
NetC13_1: C13.1(+) C15.2 J10.1 R11.1 R12.1 VD1.1(C)
NetC14_1: C14.1(+) C16.2 J14.1 R13.1 R14.1 VD2.1(C)
NetC23_2: C23.2 R15.2 U5.6(DT)
NetC25_2: C25.2 R17.2 U6.6(DT)
NetC33_2: C33.2 R23.1 R24.2
NetC34_1: C34.1(+) C36.2 J18.1 R25.1 R26.1 VD3.1(C)
NetC35_1: C35.1(+) C37.2 J19.1 R27.1 R28.1 VD4.1(C)
NetC51_1: C51.1(+) C53.2 J22.1 R32.1 R33.1 VD5.1(C)
NetC52_1: C52.1(+) C54.2 J23.1 R34.1 R35.1 VD6.1(C)
NetC56_2: C56.2 R36.2 U10.6(DT)
NetC61_2: C61.2 R40.2 U11.6(DT)
NetC69_1: C69.1(+) C73.2 J27.1 R44.1 R45.1 VD7.1(C)
NetC71_2: C71.2 R48.1 R49.2
NetC72_1: C72.1(+) C74.2 J28.1 R46.1 R47.1 VD8.1(C)
NetC81_1: C81.1(+) C83.2 J31.1 R59.1 R60.1 VD9.1(C)
NetC82_1: C82.1(+) C84.2 J32.1 R62.1 R63.1 VD10.1(C)
NetC94_2: C94.2 R64.2 U16.6(DT)
NetC96_2: C96.2 R66.2 U17.6(DT)
NetC105_2: C105.2 R74.1 R75.2
NetC106_1: C106.1(+) C108.2 J36.1 R70.1 R71.1 VD11.1(C)
NetC107_1: C107.1(+) C109.2 J37.1 R72.1 R73.1 VD12.1(C)
NetC116_1: C116.1(+) C118.2 J40.1 R79.1 R80.1 VD13.1(C)
NetC117_1: C117.1(+) C119.2 J41.1 R81.1 R82.1 VD14.1(C)
NetC121_2: C121.2 R83.2 U22.6(DT)
NetC125_2: C125.2 R85.2 U23.6(DT)
NetC132_2: C132.2 R91.1 R92.2
NetC133_1: C133.1(+) C135.2 J45.1 R89.1 R90.1 VD15.1(C)
NetC134_1: C134.1(+) C136.2 J46.1 R93.1 R94.1 VD16.1(C)
NetC?#6_1: C?#6.1 C?#9.2 C?#12.1 C?#13.2 R?#15.1 R?#19.2
NetC?#7_1: C?#7.1 C?#8.2 C?#10.1 J?#1.1 J?#2.1 J?#3.1 J?#4.1 L?#1.2 R?#16.2 TP?#4.1(G9)
NetC?#7_2: C?#7.2 C?#8.1 C?#10.2 C?#14.1 C?#15.1 C?#16.2 R?#16.1 R?#20.2
NetC?#12_2: C?#12.2 C?#13.1 C?#17.1 C?#18.2 R?#19.1 R?#32.2
NetC?#14_2: C?#14.2 C?#15.2 C?#16.1 C?#19.1 C?#20.1 C?#21.2 R?#20.1 R?#33.2
NetC?#23_2: C?#23.2 R?#27.1 R?#30.1 R?#36.2 TP?#13.1(G9)
NetC?#25_2: C?#25.2 R?#31.1 R?#42.2 R?#45.2 TP?#17.1(G9)
NetC?#28_1: C?#28.1 C?#30.1 R?#51.2 R?#53.1 U?#5.4(VIN-)
NetC?#28_2: C?#28.2 R?#49.2 U?#5.3(VIN+)
NetC?#30_2: C?#30.2 R?#50.2 R?#53.2 U?#5.1(VOUT)
NetC?#33_2: C?#33.2 C?#42.1(+) C?#43.1 U?#6.1(VDD1) U?#8.4(+Vo)
NetC?#38_1: C?#38.1(+) C?#39.2 L?#2.1 U?#7.2(VOUT)
NetC?#46_1: C?#46.1(+) C?#47.2 L?#3.1 U?#9.2(VOUT)
NetC?#53_1: C?#53.1(+) C?#54.2 L?#5.1 U?#10.2(VOUT)
NetC?#57_2: C?#57.2 C?#58.1(+) J?#7.2 L?#4.1 TP?#22.1(G9)
NetC?#66_1: C?#66.1 Y?.2
NetC?#67_1: C?#67.1 Y?.1
NetD1_1: D1.1(C) R6.1 U5.15(OUTA)
NetD1_2: D1.2(A) J8.1 R6.2 R11.2
NetD2_1: D2.1(C) R7.1 U6.15(OUTA)
NetD2_2: D2.2(A) J9.1 R7.2 R13.2
NetD3_1: D3.1(C) R19.1 U5.10(OUTB)
NetD3_2: D3.2(A) J16.1 R19.2 R25.2
NetD4_1: D4.1(C) R21.1 U6.10(OUTB)
NetD4_2: D4.2(A) J17.1 R21.2 R27.2
NetD5_1: D5.1(C) R30.1 U10.15(OUTA)
NetD5_2: D5.2(A) J20.1 R30.2 R32.2
NetD6_1: D6.1(C) R31.1 U11.15(OUTA)
NetD6_2: D6.2(A) J21.1 R31.2 R34.2
NetD7_1: D7.1(C) R42.1 U10.10(OUTB)
NetD7_2: D7.2(A) J24.1 R42.2 R44.2
NetD8_1: D8.1(C) R43.1 U11.10(OUTB)
NetD8_2: D8.2(A) J25.1 R43.2 R46.2
NetD9_1: D9.1(C) R51.1 U16.15(OUTA)
NetD9_2: D9.2(A) J29.1 R51.2 R59.2
NetD10_1: D10.1(C) R52.1 U17.15(OUTA)
NetD10_2: D10.2(A) J30.1 R52.2 R62.2
NetD11_1: D11.1(C) R68.1 U16.10(OUTB)
NetD11_2: D11.2(A) J33.1 R68.2 R70.2
NetD12_1: D12.1(C) R69.1 U17.10(OUTB)
NetD12_2: D12.2(A) J35.1 R69.2 R72.2
NetD13_1: D13.1(C) R77.1 U22.15(OUTA)
NetD13_2: D13.2(A) J38.1 R77.2 R79.2
NetD14_1: D14.1(C) R78.1 U23.15(OUTA)
NetD14_2: D14.2(A) J39.1 R78.2 R81.2
NetD15_1: D15.1(C) R87.1 U22.10(OUTB)
NetD15_2: D15.2(A) J43.1 R87.2 R89.2
NetD16_1: D16.1(C) R88.1 U23.10(OUTB)
NetD16_2: D16.2(A) J44.1 R88.2 R93.2
NetD30_1: D30.1(A) R?#5.1
NetD31_1: D31.1(A) R?#6.1
NetD?#1_1: D?#1.1(A) R113.1
NetD?#2_1: D?#2.1(A) R?#7.1
NetD?#3_1: D?#3.1(A) R?#8.1
NetD?#4_1: D?#4.1(A) R?#9.1
NetD?#5_1: D?#5.1(A) R?#38.1
NetD?#6_1: D?#6.1(A) R?#41.1
NetD?#7_1: D?#7.1(A) R?#54.1
NetJ2_1: J2.1 L2.2
NetJ12_1: J12.1 L2.1
NetJ15_1: J15.1 U8.5(-IP)
NetJ26_1: J26.1 U14.5(-IP)
NetJ34_1: J34.1 U20.5(-IP)
NetJ42_1: J42.1 U25.5(-IP)
NetJ?#5_2: J?#5.2 U?#2.4(+IP)
NetJ?#6_1: J?#6.1 R?#40.2 U?#4.7(B) ZD?#1.2(A)
NetJ?#6_3: J?#6.3 R?#22.1 U?#4.6(A) ZD?#2.2(A)
NetP4_2: P4.2 R?#43.1
NetP?#1_2: P?#1.2 R?#2.1
NetP?#2_2: P?#2.2 R?#3.1
NetP?#3_2: P?#3.2 R?#4.1
NetP?#5_2: P?#5.2 R?#44.1
NetQ?#1_1: Q?#1.1(B) R?#64.2 R?#65.1
NetQ?#2_1: Q?#2.1(B) R?#73.2 R?#74.1
NetQ?#3_1: Q?#3.1(B) R?#82.2 R?#83.1
NetQ?#4_1: Q?#4.1(B) R?#85.2 R?#86.1
NetR24_1: R24.1 U8.3(OUT)
NetR49_1: R49.1 U14.3(OUT)
NetR75_1: R75.1 U20.3(OUT)
NetR92_1: R92.1 U25.3(OUT)
NetR?#14_1: R?#14.1 R?#18.2
NetR?#17_1: R?#17.1 R?#21.2
NetR?#18_1: R?#18.1 R?#29.2
NetR?#21_1: R?#21.1 R?#31.2
NetR?#25_1: R?#25.1 R?#34.1 TP?#14.1(G9) U?#4.1(RO)
NetR?#26_1: R?#26.1 R?#28.1 TP?#11.1(G9) U?#4.4(DI)
NetR?#27_2: R?#27.2 TP?#8.1(G9) U?#2.3(OUT)
NetR?#28_2: R?#28.2 U?#3.13(VOB)
NetR?#29_1: R?#29.1 R?#41.2 VD?.1(C)
NetR?#34_2: R?#34.2 U?#3.11(VID)
NetR?#37_2: R?#37.2 TP?#15.1(G9) U?#3.12(VOC) U?#4.2(~{RE}) U?#4.3(DE)

Not connected (* = marked no-connect by the designer): U5 7(NC) 12(NC) 13(NC); U6 7(NC) 12(NC) 13(NC); U10 7(NC) 12(NC) 13(NC); U11 7(NC) 12(NC) 13(NC); U16 7(NC) 12(NC) 13(NC); U17 7(NC) 12(NC) 13(NC); U22 7(NC) 12(NC) 13(NC); U23 7(NC) 12(NC) 13(NC); U?#3 3(VIA) 14(VOA); U?#11 5(PF0/OSC_IN) 6(PF1/OSC_OUT) 7(NRST) 9(PC1) 10(PC2) 25(PC5) 40(PC9) 54(PD2) 60(BOOT0)

## Layout directives
net class HV: NetC?#7_1, NetJ2_1, NetJ12_1, NetJ?#5_2, NetR?#29_1, V_PS